# Altium project Wilamp_DCU.PrjPCB (part 1 of 2)
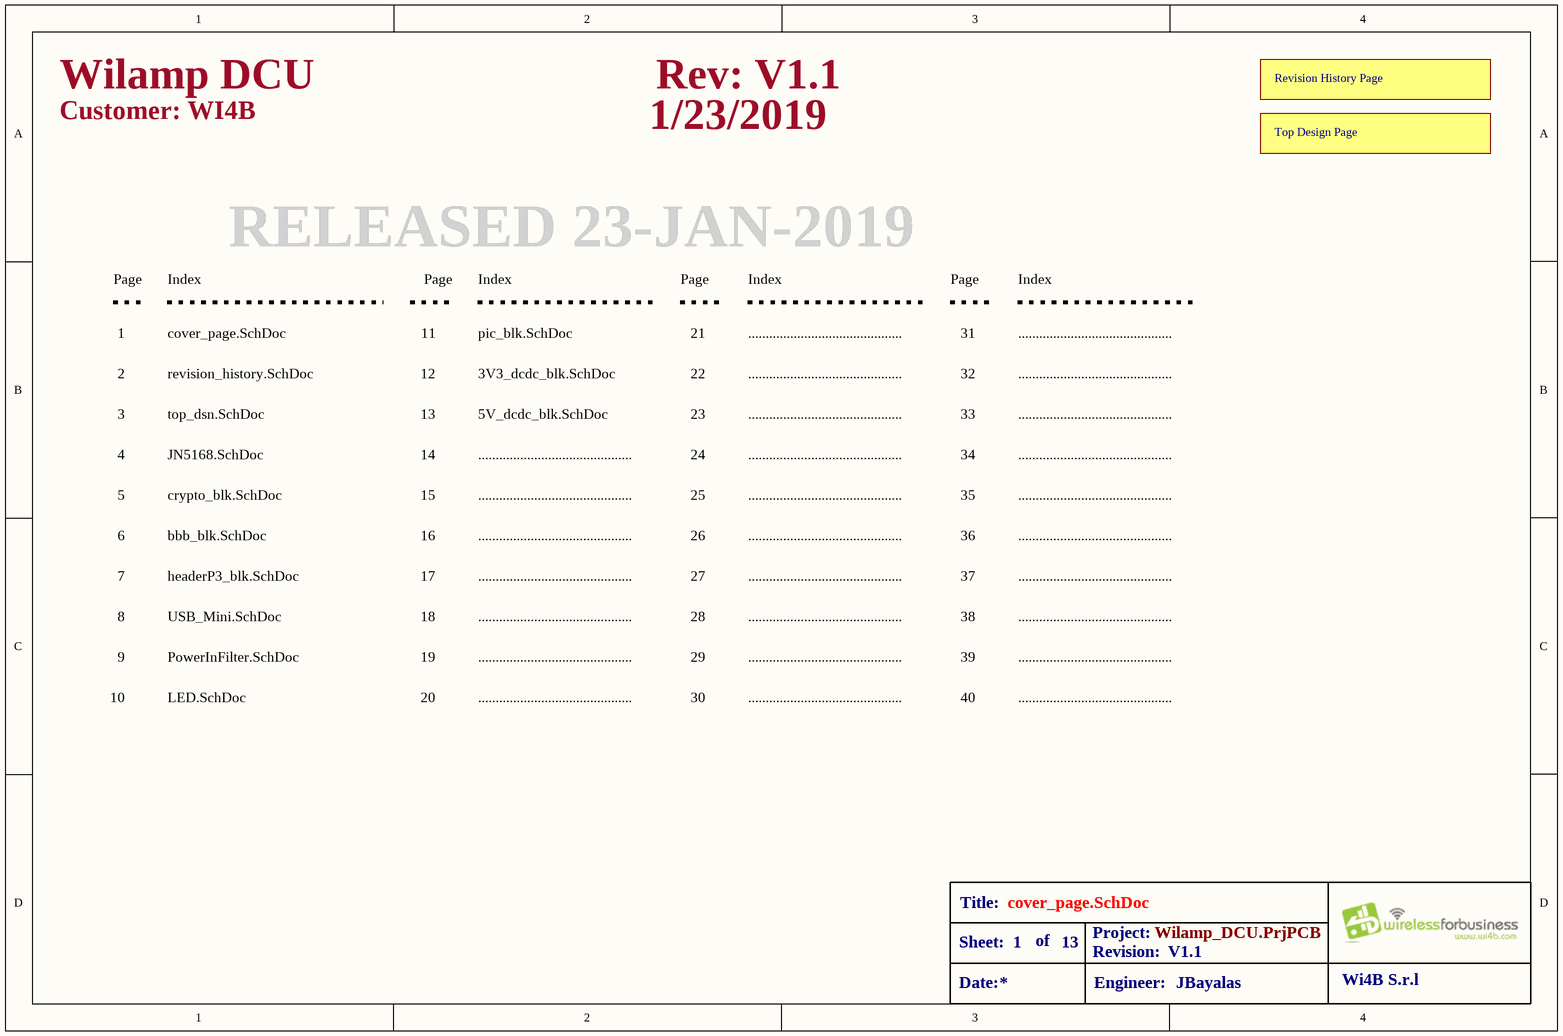
[diagram p0: cover_page.SchDoc]
13 sheets, 210 parts. Net scope: hierarchical (ports join the sheet entries above them; power ports are global).
Board file: wilamp_DCU.PcbDoc
Sheets:
  cover_page.SchDoc
    Top Design Page = top_dsn.SchDoc
      JN1 = JN5168.SchDoc
      JN2 = JN5168.SchDoc
      JN3 = JN5168.SchDoc
      crypto_blk = crypto_blk.SchDoc
      bbb_conn_blk = bbb_blk.SchDoc
      PFilter = PowerInFilter.SchDoc
      U_LED = LED.SchDoc
      U_USB_Mini = USB_Mini.SchDoc
      U_5v_dcdc_blk = 5v_dcdc_blk.SchDoc
      U_3v3_dcdc_blk = 3v3_dcdc_blk.SchDoc
      U_headerP3_blk = headerP3_blk.SchDoc
      U_pic_blk = pic_blk.SchDoc
    Revision History Page = revision_history.SchDoc

## Sheet cover_page.SchDoc
size A4; Date: 1/11/16; Engineer: JBayalas; DocumentNumber: 1; Revision: V1.1; SheetNumber: 1; SheetTotal: 13

### Sub-sheets
Revision History Page = revision_history.SchDoc: no entries
Top Design Page = top_dsn.SchDoc: no entries

### Notes on the sheet
- Wilamp DCU
- Rev: V1.1
- Customer: WI4B
- 1/23/2019
- Page
- Index
- RELEASED 23-JAN-2019
- 1
- 2
- revision_history.SchDoc
- cover_page.SchDoc
- 11
- 12
- 3V3_dcdc_blk.SchDoc
- pic_blk.SchDoc
- 21
- 22
- ............................................
- 31
- 32
- 3
- top_dsn.SchDoc
- 13
- 5V_dcdc_blk.SchDoc
- 23
- 33
- 4
- 5
- crypto_blk.SchDoc
- JN5168.SchDoc
- 14
- 15
- 24
- 25
- 34
- 35
- 6
- 7
- bbb_blk.SchDoc
- headerP3_blk.SchDoc
- 16
- 17
- 26
- 27
- 36
- 37
- 8
- USB_Mini.SchDoc
- 18
- 28
- 38
- 9
- 10
- PowerInFilter.SchDoc
- LED.SchDoc
- 19
- 20
- 29
- 30
- 39
- 40
- Title:
- Sheet:
- Date:
- of
- Project:
- Revision:
- Engineer:
- Wi4B S.r.l

## Sheet top_dsn.SchDoc
size A4; Date: 1/11/16; Engineer: JBayalas; DocumentNumber: 3; Revision: V1.1; SheetNumber: 3; SheetTotal: 13
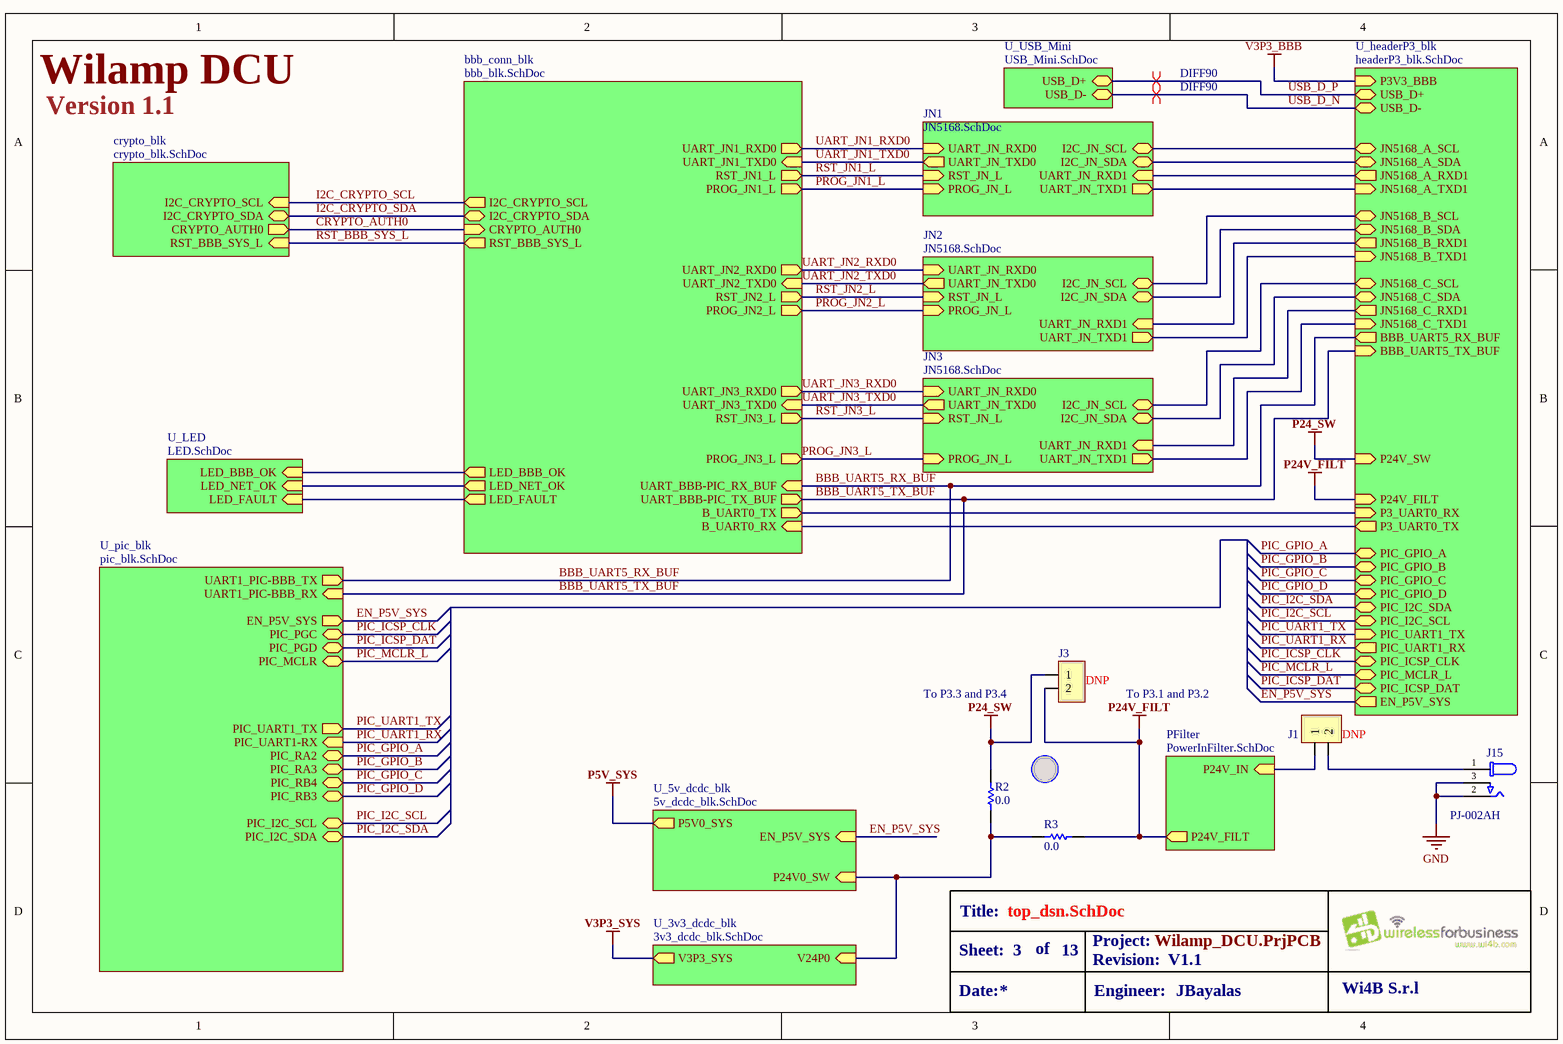
[diagram p1: top_dsn.SchDoc]

### Parts
J1  LOAD: DNP  [2pin 5mm Pitch]  (hidden comment: *)
J3  LOAD: DNP  [2pin 5mm Pitch]  (hidden comment: *)
J15  *  [PJ-002AH]  (value not drawn)
R2  value 0.0  [R0805]  (hidden comment: *)
R3  value 0.0  [R0805]  (hidden comment: *)

### Sub-sheets
bbb_conn_blk = bbb_blk.SchDoc: I2C_CRYPTO_SCL (out), I2C_CRYPTO_SDA (bidir), CRYPTO_AUTH0 (in), RST_BBB_SYS_L (out), UART_JN1_TXD0 (in), UART_JN1_RXD0 (out), UART_JN2_TXD0 (in), UART_JN2_RXD0 (out), UART_JN3_TXD0 (in), UART_JN3_RXD0 (out), LED_NET_OK (out), LED_BBB_OK (out), LED_FAULT (out), RST_JN1_L (out), RST_JN2_L (out), RST_JN3_L (out), PROG_JN1_L (out), PROG_JN2_L (out), PROG_JN3_L (out), UART_BBB-PIC_RX_BUF (in), UART_BBB-PIC_TX_BUF (out), B_UART0_RX (in), B_UART0_TX (out)
crypto_blk = crypto_blk.SchDoc: I2C_CRYPTO_SCL (in), I2C_CRYPTO_SDA (bidir), CRYPTO_AUTH0 (out), RST_BBB_SYS_L (in)
JN1 = JN5168.SchDoc: UART_JN_TXD0 (out), UART_JN_RXD0 (in), I2C_JN_SDA (bidir), I2C_JN_SCL (bidir), RST_JN_L (in), PROG_JN_L (in), UART_JN_TXD1 (out), UART_JN_RXD1 (in)
JN2 = JN5168.SchDoc: UART_JN_TXD0 (out), UART_JN_RXD0 (in), I2C_JN_SDA (bidir), I2C_JN_SCL (bidir), RST_JN_L (in), PROG_JN_L (in), UART_JN_TXD1 (out), UART_JN_RXD1 (in)
JN3 = JN5168.SchDoc: UART_JN_TXD0 (out), UART_JN_RXD0 (in), I2C_JN_SCL (bidir), I2C_JN_SDA (bidir), RST_JN_L (in), PROG_JN_L (in), UART_JN_TXD1 (out), UART_JN_RXD1 (in)
PFilter = PowerInFilter.SchDoc: P24V_FILT (out), P24V_IN (in)
U_3v3_dcdc_blk = 3v3_dcdc_blk.SchDoc: V3P3_SYS (out), V24P0 (in)
U_5v_dcdc_blk = 5v_dcdc_blk.SchDoc: P5V0_SYS (out), P24V0_SW (in), EN_P5V_SYS (in)
U_headerP3_blk = headerP3_blk.SchDoc: P3V3_BBB (in), PIC_ICSP_DAT (bidir), PIC_UART1_RX (out), BBB_UART5_TX_BUF (in), PIC_I2C_SDA (bidir), PIC_GPIO_B (bidir), PIC_GPIO_D (bidir), JN5168_A_RXD1 (out), JN5168_A_SDA (bidir), JN5168_B_RXD1 (out), JN5168_B_SDA (bidir), JN5168_C_RXD1 (out), JN5168_C_SDA (bidir), USB_D- (bidir), EN_P5V_SYS (out), PIC_ICSP_CLK (bidir), PIC_UART1_TX (in), BBB_UART5_RX_BUF (out), PIC_I2C_SCL (bidir), PIC_GPIO_A (bidir), PIC_GPIO_C (bidir), JN5168_A_TXD1 (in), JN5168_A_SCL (bidir), JN5168_B_TXD1 (in), JN5168_B_SCL (bidir), JN5168_C_TXD1 (in), JN5168_C_SCL (bidir), USB_D+ (bidir), PIC_MCLR_L (bidir), P24V_FILT (in), P24V_SW (in), P3_UART0_RX (in), P3_UART0_TX (out)
U_LED = LED.SchDoc: LED_BBB_OK (in), LED_NET_OK (in), LED_FAULT (in)
U_pic_blk = pic_blk.SchDoc: PIC_I2C_SCL (bidir), PIC_I2C_SDA (bidir), PIC_PGD (bidir), PIC_PGC (bidir), PIC_MCLR (bidir), PIC_RA2 (bidir), PIC_RA3 (bidir), UART1_PIC-BBB_RX (in), UART1_PIC-BBB_TX (out), PIC_UART1_TX (out), PIC_UART1-RX (in), EN_P5V_SYS (out), PIC_RB3 (bidir), PIC_RB4 (bidir)
U_USB_Mini = USB_Mini.SchDoc: USB_D+ (bidir), USB_D- (bidir)

### Nets
GND: J15.2 J15.3
P24_SW: J3.1 R2.2 ; sheet U_headerP3_blk/P24V_SW
P24V_FILT: J3.2 R3.2 ; sheet PFilter/P24V_FILT, sheet U_headerP3_blk/P24V_FILT
B_UART0_RX: sheet bbb_conn_blk/B_UART0_RX, sheet U_headerP3_blk/P3_UART0_TX
B_UART0_TX: sheet bbb_conn_blk/B_UART0_TX, sheet U_headerP3_blk/P3_UART0_RX
BBB_UART5_RX_BUF: sheet bbb_conn_blk/UART_BBB-PIC_RX_BUF, sheet U_headerP3_blk/BBB_UART5_RX_BUF, sheet U_pic_blk/UART1_PIC-BBB_TX
BBB_UART5_TX_BUF: sheet bbb_conn_blk/UART_BBB-PIC_TX_BUF, sheet U_headerP3_blk/BBB_UART5_TX_BUF, sheet U_pic_blk/UART1_PIC-BBB_RX
CRYPTO_AUTH0: sheet crypto_blk/CRYPTO_AUTH0, sheet bbb_conn_blk/CRYPTO_AUTH0
EN_P5V_SYS: sheet U_5v_dcdc_blk/EN_P5V_SYS, sheet U_headerP3_blk/EN_P5V_SYS, sheet U_pic_blk/EN_P5V_SYS
I2C_CRYPTO_SCL: sheet crypto_blk/I2C_CRYPTO_SCL, sheet bbb_conn_blk/I2C_CRYPTO_SCL
I2C_CRYPTO_SDA: sheet crypto_blk/I2C_CRYPTO_SDA, sheet bbb_conn_blk/I2C_CRYPTO_SDA
I2C_JN_SCL: sheet JN1/I2C_JN_SCL, sheet U_headerP3_blk/JN5168_A_SCL
I2C_JN_SCL: sheet JN2/I2C_JN_SCL, sheet U_headerP3_blk/JN5168_B_SCL  [a separate net that carries the same name]
I2C_JN_SCL: sheet JN3/I2C_JN_SCL, sheet U_headerP3_blk/JN5168_C_SCL  [a separate net that carries the same name]
I2C_JN_SDA: sheet JN1/I2C_JN_SDA, sheet U_headerP3_blk/JN5168_A_SDA
I2C_JN_SDA: sheet JN2/I2C_JN_SDA, sheet U_headerP3_blk/JN5168_B_SDA  [a separate net that carries the same name]
I2C_JN_SDA: sheet JN3/I2C_JN_SDA, sheet U_headerP3_blk/JN5168_C_SDA  [a separate net that carries the same name]
LED_BBB_OK: sheet bbb_conn_blk/LED_BBB_OK, sheet U_LED/LED_BBB_OK
LED_FAULT: sheet bbb_conn_blk/LED_FAULT, sheet U_LED/LED_FAULT
LED_NET_OK: sheet bbb_conn_blk/LED_NET_OK, sheet U_LED/LED_NET_OK
P24V: J1.1 ; sheet PFilter/P24V_IN
PIC_GPIO_A: sheet U_headerP3_blk/PIC_GPIO_A, sheet U_pic_blk/PIC_RA2
PIC_GPIO_B: sheet U_headerP3_blk/PIC_GPIO_B, sheet U_pic_blk/PIC_RA3
PIC_GPIO_C: sheet U_headerP3_blk/PIC_GPIO_C, sheet U_pic_blk/PIC_RB4
PIC_GPIO_D: sheet U_headerP3_blk/PIC_GPIO_D, sheet U_pic_blk/PIC_RB3
PIC_I2C_SCL: sheet U_headerP3_blk/PIC_I2C_SCL, sheet U_pic_blk/PIC_I2C_SCL
PIC_I2C_SDA: sheet U_headerP3_blk/PIC_I2C_SDA, sheet U_pic_blk/PIC_I2C_SDA
PIC_ICSP_CLK: sheet U_headerP3_blk/PIC_ICSP_CLK, sheet U_pic_blk/PIC_PGC
PIC_ICSP_DAT: sheet U_headerP3_blk/PIC_ICSP_DAT, sheet U_pic_blk/PIC_PGD
PIC_MCLR_L: sheet U_headerP3_blk/PIC_MCLR_L, sheet U_pic_blk/PIC_MCLR  [project net PIC_MCLR]
PIC_UART1_RX: sheet U_headerP3_blk/PIC_UART1_RX, sheet U_pic_blk/PIC_UART1-RX
PIC_UART1_TX: sheet U_headerP3_blk/PIC_UART1_TX, sheet U_pic_blk/PIC_UART1_TX
PROG_JN1_L: sheet JN1/PROG_JN_L, sheet bbb_conn_blk/PROG_JN1_L
PROG_JN2_L: sheet JN2/PROG_JN_L, sheet bbb_conn_blk/PROG_JN2_L
PROG_JN3_L: sheet JN3/PROG_JN_L, sheet bbb_conn_blk/PROG_JN3_L
RST_BBB_SYS_L: sheet crypto_blk/RST_BBB_SYS_L, sheet bbb_conn_blk/RST_BBB_SYS_L
RST_JN1_L: sheet JN1/RST_JN_L, sheet bbb_conn_blk/RST_JN1_L
RST_JN2_L: sheet JN2/RST_JN_L, sheet bbb_conn_blk/RST_JN2_L
RST_JN3_L: sheet JN3/RST_JN_L, sheet bbb_conn_blk/RST_JN3_L
UART_JN1_RXD0: sheet JN1/UART_JN_RXD0, sheet bbb_conn_blk/UART_JN1_RXD0
UART_JN1_TXD0: sheet JN1/UART_JN_TXD0, sheet bbb_conn_blk/UART_JN1_TXD0
UART_JN2_RXD0: sheet JN2/UART_JN_RXD0, sheet bbb_conn_blk/UART_JN2_RXD0
UART_JN2_TXD0: sheet JN2/UART_JN_TXD0, sheet bbb_conn_blk/UART_JN2_TXD0
UART_JN3_RXD0: sheet JN3/UART_JN_RXD0, sheet bbb_conn_blk/UART_JN3_RXD0
UART_JN3_TXD0: sheet JN3/UART_JN_TXD0, sheet bbb_conn_blk/UART_JN3_TXD0
USB_D_N: sheet U_USB_Mini/USB_D-, sheet U_headerP3_blk/USB_D-
USB_D_P: sheet U_USB_Mini/USB_D+, sheet U_headerP3_blk/USB_D+
V24P0: R2.1 R3.1 ; sheet U_5v_dcdc_blk/P24V0_SW, sheet U_3v3_dcdc_blk/V24P0
NetJ1_2: J1.2 J15.1
NetP3_29: sheet JN1/UART_JN_TXD1, sheet U_headerP3_blk/JN5168_A_TXD1
NetP3_30: sheet JN1/UART_JN_RXD1, sheet U_headerP3_blk/JN5168_A_RXD1
NetP3_33: sheet JN2/UART_JN_TXD1, sheet U_headerP3_blk/JN5168_B_TXD1
NetP3_34: sheet JN2/UART_JN_RXD1, sheet U_headerP3_blk/JN5168_B_RXD1
NetP3_37: sheet JN3/UART_JN_TXD1, sheet U_headerP3_blk/JN5168_C_TXD1
NetP3_38: sheet JN3/UART_JN_RXD1, sheet U_headerP3_blk/JN5168_C_RXD1

### Layout directives
differential pair; net class DIFF90: USB_D_N, USB_D_P

### Notes on the sheet
- Version 1.1
- Wilamp DCU
- (near J3) To P3.3 and P3.4
- To P3.1 and P3.2
- Title:
- Sheet:
- Date:
- of
- Project:
- Revision:
- Engineer:
- Wi4B S.r.l

### Library data of the parts
J1 J3 = 2PIN Signal 5mm Pitch: FUNCTION: TOP
J15 = PJ-002AH: CONN PWR JACK 2.1X5.5MM HIGH CUR; MFT: CUI Inc.; FUNCTION: TOP; VALUE: PJ-002AH; TYPE: TH; RATING: *; LOAD: *; MPN: PJ-002AH
R2 R3 = RC0805JR-070RL: RES SMD 0.0 OHM JUMPER 1/8W 0805; MFT: Yageo; FUNCTION: TOP; MPN: RC0805JR-070RL; TYPE: Surface Mount; RATING: 1/8W

## Sheet JN5168.SchDoc
size A4; Date: 1/11/2016; Engineer: JBayalas; DocumentNumber: 4; Revision: V1.1; SheetNumber: 4; SheetTotal: 13
Used 3 times, as channels Top Design Page/JN1, Top Design Page/JN2, Top Design Page/JN3. Parts and nets are listed once, with the designators drawn on the sheet.
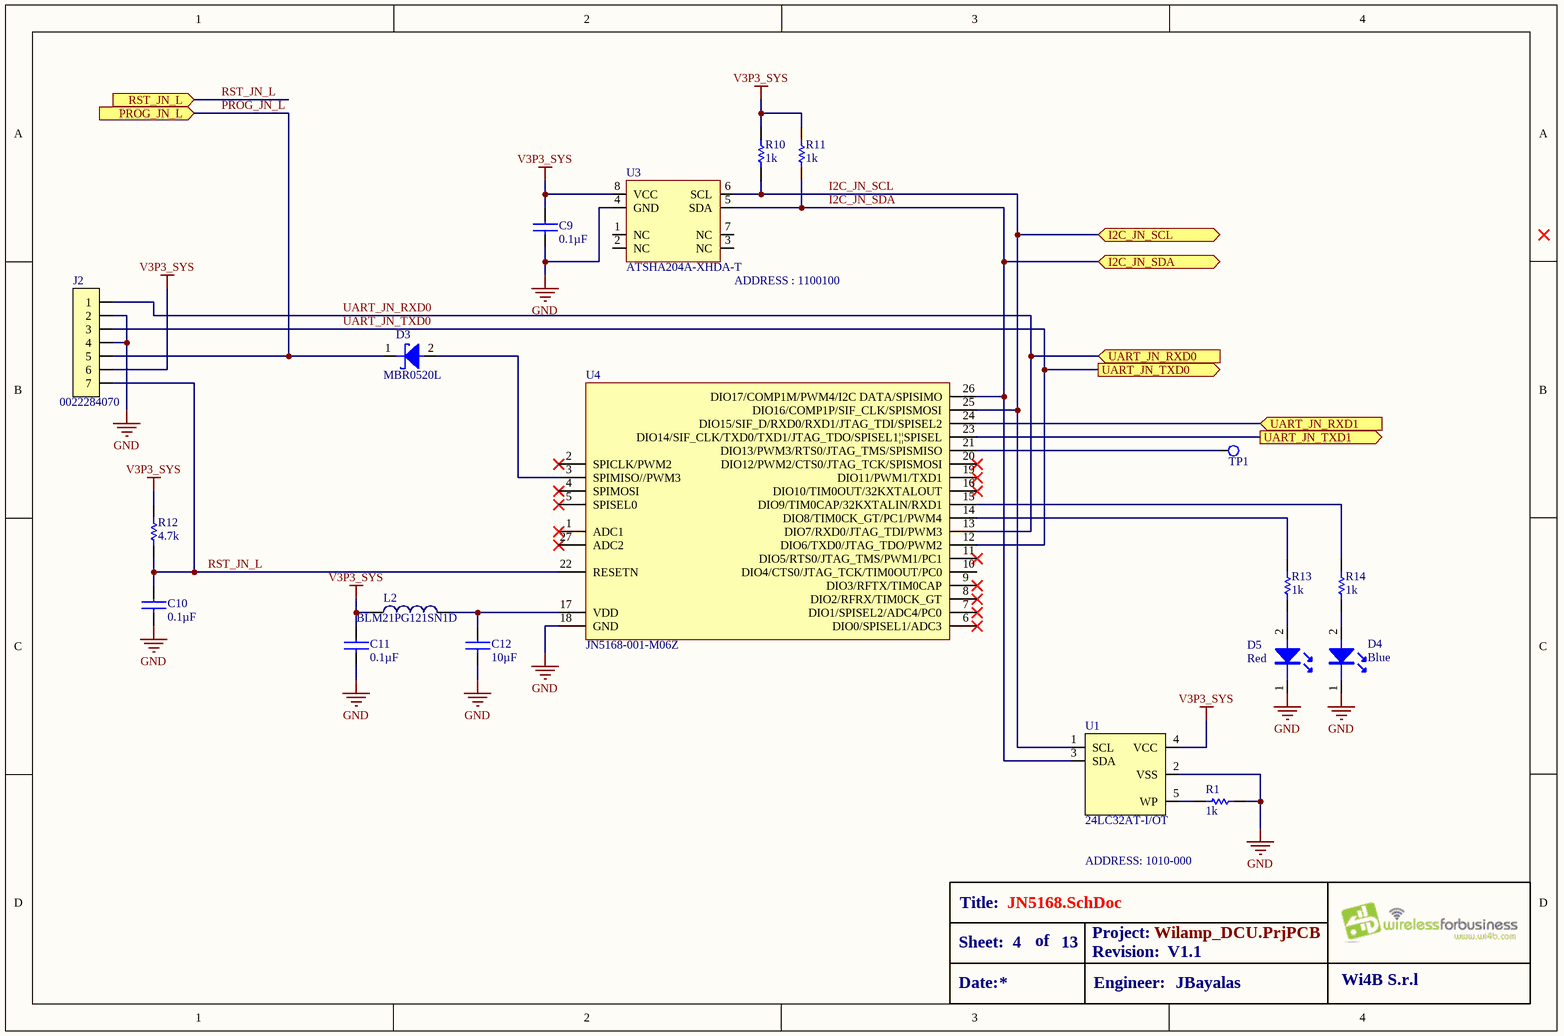
[diagram p2: JN5168.SchDoc]

### Parts
C9  value 0.1µF  [C0402]  (hidden comment: *)
C10  value 0.1µF  [C0402]  (hidden comment: *)
C11  value 0.1µF  [C0402]  (hidden comment: *)
C12  value 10µF  [C0805]  (hidden comment: *)
D3  MBR0520L  [SOD123]
D4  value Blue  [LED-0603 (BLUE)]  (hidden comment: *)
D5  value Red  [LED0805 - (RED)]  (hidden comment: *)
J2  *  [0022284070]  (value not drawn)
L2  *  [0805 INDUCTOR]  (value not drawn)
R1  value 1k  [R0402]  (hidden comment: *)
R10  value 1k  [R0402]  (hidden comment: *)
R11  value 1k  [R0402]  (hidden comment: *)
R12  value 4.7k  [R0603]  (hidden comment: *)
R13  value 1k  [R0603]  (hidden comment: *)
R14  value 1k  [R0603]  (hidden comment: *)
TP1  *  [Test Point 1.27mm]  (value not drawn)
U1  *  [SOT-23-5]  (value not drawn)
U3  ATSHA204A-XHDA-T  [TSSOP-8 (wide Body)]
U4  JN5168-001-M06Z  [JN5168-001-M06Z]

### Ports
I2C_JN_SCL (bidir), I2C_JN_SDA (bidir), PROG_JN_L (in), RST_JN_L (in), UART_JN_RXD0 (in), UART_JN_RXD1 (in), UART_JN_TXD0 (out), UART_JN_TXD1 (out)

### Nets
GND: C9.2 C10.2 C11.2 C12.2 D4.1 D5.1 J2.2 J2.4 R1.2 U1.2(VSS) U3.4(GND) U4.18(GND)
V3P3_SYS: C9.1 C11.1 J2.6 L2.2 R10.2 R11.2 R12.2 U1.4(VCC) U3.8(VCC)
I2C_JN_SCL: R10.1 U1.1(SCL) U3.6(SCL) U4.25(DIO16/COMP1P/SIF_CLK/SPISMOSI) ; port I2C_JN_SCL
I2C_JN_SDA: R11.1 U1.3(SDA) U3.5(SDA) U4.26(DIO17/COMP1M/PWM4/I2C_DATA/SPISIMO) ; port I2C_JN_SDA
PROG_JN_L: D3.1(cathode) J2.5 ; port PROG_JN_L
RST_JN_L: C10.1 J2.7 R12.1 U4.22(RESETN) ; port RST_JN_L
UART_JN_RXD0: J2.1 U4.13(DIO7/RXD0/JTAG_TDI/PWM3) ; port UART_JN_RXD0
UART_JN_RXD1: U4.24(DIO15/SIF_D/RXD0/RXD1/JTAG_TDI/SPISEL2) ; port UART_JN_RXD1
UART_JN_TXD0: J2.3 U4.12(DIO6/TXD0/JTAG_TDO/PWM2) ; port UART_JN_TXD0
UART_JN_TXD1: U4.23(DIO14/SIF_CLK/TXD0/TXD1/JTAG_TDO/SPISEL1||SPISEL) ; port UART_JN_TXD1
NetC12_1: C12.1 L2.1 U4.17(VDD)
NetD3_2: D3.2(anode) U4.3(SPIMISO//PWM3)
NetD4_2: D4.2 R14.2
NetD5_2: D5.2 R13.2
NetR1_1: R1.1 U1.5(WP)
NetR13_1: R13.1 U4.14(DIO8/TIM0CK_GT/PC1/PWM4)
NetR14_1: R14.1 U4.15(DIO9/TIM0CAP/32KXTALIN/RXD1)
NetTP1_1: TP1.1 U4.21(DIO13/PWM3/RTS0/JTAG_TMS/SPISMISO)

Not connected (* = marked no-connect by the designer): U3 1(NC) 2(NC) 3(NC) 7(NC); U4 1(ADC1)* 2(SPICLK/PWM2)* 4(SPIMOSI)* 5(SPISEL0)* 6(DIO0/SPISEL1/ADC3)* 7(DIO1/SPISEL2/ADC4/PC0)* 8(DIO2/RFRX/TIM0CK_GT)* 9(DIO3/RFTX/TIM0CAP)* 10(DIO4/CTS0/JTAG_TCK/TIM0OUT/PC0) 11(DIO5/RTS0/JTAG_TMS/PWM1/PC1)* 16(DIO10/TIM0OUT/32KXTALOUT)* 19(DIO11/PWM1/TXD1)* 20(DIO12/PWM2/CTS0/JTAG_TCK/SPISMOSI)* 27(ADC2)*

### Channels
Top Design Page/JN1: designators end in _JN1; ports I2C_JN_SCL=I2C_JN_SCL I2C_JN_SDA=I2C_JN_SDA PROG_JN_L=PROG_JN1_L RST_JN_L=RST_JN1_L UART_JN_RXD0=UART_JN1_RXD0 UART_JN_RXD1=NetP3_30 UART_JN_TXD0=UART_JN1_TXD0 UART_JN_TXD1=NetP3_29
Top Design Page/JN2: designators end in _JN2; ports I2C_JN_SCL=I2C_JN_SCL I2C_JN_SDA=I2C_JN_SDA PROG_JN_L=PROG_JN2_L RST_JN_L=RST_JN2_L UART_JN_RXD0=UART_JN2_RXD0 UART_JN_RXD1=NetP3_34 UART_JN_TXD0=UART_JN2_TXD0 UART_JN_TXD1=NetP3_33
Top Design Page/JN3: designators end in _JN3; ports I2C_JN_SCL=I2C_JN_SCL I2C_JN_SDA=I2C_JN_SDA PROG_JN_L=PROG_JN3_L RST_JN_L=RST_JN3_L UART_JN_RXD0=UART_JN3_RXD0 UART_JN_RXD1=NetP3_38 UART_JN_TXD0=UART_JN3_TXD0 UART_JN_TXD1=NetP3_37

### Notes on the sheet
- (near U3) ADDRESS : 1100100
- ADDRESS: 1010-000
- Title:
- Sheet:
- Date:
- of
- Project:
- Revision:
- Engineer:
- Wi4B S.r.l

### Library data of the parts
C9-C11 = CL05B104KO3LNNC: CAP CER 0.1UF 16V X7R 0402; MFT: Samsung Electro-Mechanics America, Inc.; RATING: ±10%, 16V; TYPE: Surface Mount, MLCC; FUNCTION: JENNIC; MPN: CL05B104KO3LNNC
C12 = GRM219R60J106KE19D: CAP CER 10UF 6.3V X5R 0805; MFT: Murata Electronics North America; TYPE: Surface Mount, MLCC; FUNCTION: JENNIC; MPN: GRM219R60J106KE19D; RATING: 6.3V
D3 = MBR0520L: DIODE SCHOTTKY 20V 0.5A SOD123; MFT: ON Semiconductor; TYPE: SMD; RATING: 20V 500MA; FUNCTION: JENNIC; VALUE: MBR0520L; MPN: MBR0520L
D4 = LTST-C191TBKT: LED BLUE CLEAR 0603 SMD; MFT: Lite-On Inc.; TYPE: Surface Mount; FUNCTION: JENNIC; MPN: LTST-C191TBKT
D5 = LS R976-NR-1: LED CHIPLED 633NM RED 0805 SMD; MFT: OSRAM Opto Semiconductors Inc.; FUNCTION: JENNIC; MPN: LS R976-NR-1
J2 = 0022284070: CONN HEADER 7POS .100 VERT TIN; MFT: Molex, LLC; FUNCTION: JENNIC; VALUE: 0022284070; TYPE: TH; RATING: *; LOAD: *; MPN: 0022284070
L2 = BLM21PG121SN1D: FERRITE CHIP 120 OHM 0805; MFT: Murata Electronics North America; RATING: 3A; TYPE: Surface Mount; VALUE: 120 Ohm; FUNCTION: JENNIC; MPN: BLM21PG121SN1D
R1 R10 R11 = MCS04020C1001FE000: RES SMD 1K OHM 1% 1/10W 0402; MFT: Vishay Beyschlag; FUNCTION: JENNIC; MPN: MCS04020C1001FE000; TYPE: SMD; RATING: 1/10W; LOAD: *
R12 = ERA-3AEB472V: RES SMD 4.7K OHM 0.1% 1/10W 0603; MFT: Panasonic; FUNCTION: JENNIC; MPN: ERA-3AEB472V; LOAD: *; RATING: 1/10W; TYPE: SMD
R13 R14 = ERJ-3EKF1001V: RES SMD 1K OHM 1% 1/10W 0603; MFT: Panasonic Electronic Components; RATING: 0.1W; FUNCTION: JENNIC; MPN: ERJ-3EKF1001V; TYPE: Surface Mount
TP1 = Test Point: Test Point 1.27mm; FUNCTION: JENNIC
U1 = 24LC32AT-I/OT: IC EEPROM 32KBIT 400KHZ SOT23-5; MFT: Microchip Technology; FUNCTION: JENNIC; VALUE: 24LC32AT-I/OT; TYPE: SMD; RATING: *; LOAD: *; MPN: 24LC32AT-I/OT
U3 = ATSHA204A-XHDA-T: IC CRYPTO 4.5KB I2C; MFT: Microchip Technology; FUNCTION: JENNIC; LOAD: *; TYPE: SMD; VALUE: ATSHA204A-XHDA-T; RATING: *; MPN: ATSHA204A-XHDA-T
U4 = JN5168-001-M06Z: RF TXRX MODULE 802.15.4 U.FL ANT; MFT: NXP USA Inc.; FUNCTION: JENNIC; VALUE: JN5168-001-M06Z; TYPE: SMD; RATING: *; LOAD: *; MPN: JN5168-001-M06Z

## Sheet crypto_blk.SchDoc
size A4; Engineer: JBayalas; DocumentNumber: 5; Revision: V1.1; SheetNumber: 5; SheetTotal: 13
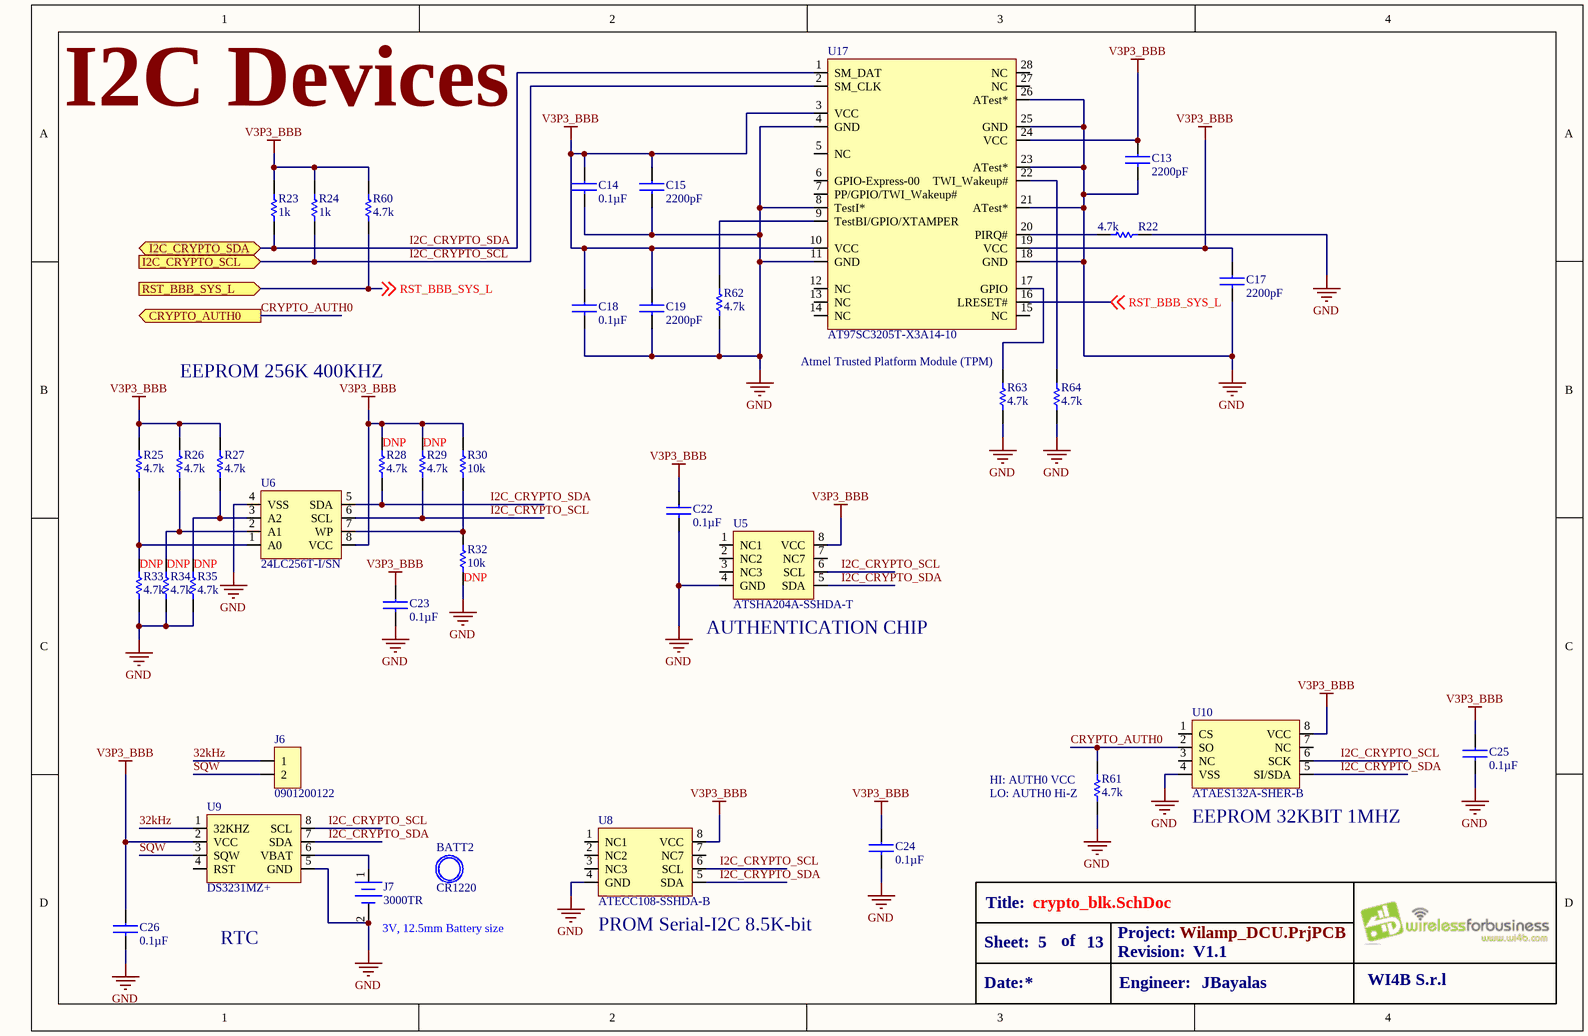
[diagram p3: crypto_blk.SchDoc]

### Parts
BATT2  CR1220
C13  value 2200pF  [C0805]  (hidden comment: *)
C14  value 0.1µF  [C0402]  (hidden comment: *)
C15  value 2200pF  [C0805]  (hidden comment: *)
C17  value 2200pF  [C0603]  (hidden comment: *)
C18  value 0.1µF  [C0402]  (hidden comment: *)
C19  value 2200pF  [C0805]  (hidden comment: *)
C22  value 0.1µF  [C0402]  (hidden comment: *)
C23  value 0.1µF  [C0402]  (hidden comment: *)
C24  value 0.1µF  [C0402]  (hidden comment: *)
C25  value 0.1µF  [C0402]  (hidden comment: *)
C26  value 0.1µF  [C0402]  (hidden comment: *)
J6  *  [0901200122]  (value not drawn)
J7  3000TR  [3000TR]
R22  value 4.7k  [R0402]  (hidden comment: RC0402JR-074K7L)
R23  value 1k  [R0402]  (hidden comment: *)
R24  value 1k  [R0402]  (hidden comment: *)
R25  value 4.7k  [R0402]  (hidden comment: *)
R26  value 4.7k  [R0402]  (hidden comment: *)
R27  value 4.7k  [R0402]  (hidden comment: *)
R28  value 4.7k  LOAD: DNP  [R0402]  (hidden comment: *)
R29  value 4.7k  LOAD: DNP  [R0402]  (hidden comment: *)
R30  value 10k  [R0402]  (hidden comment: *)
R32  value 10k  LOAD: DNP  [R0402]  (hidden comment: *)
R33  value 4.7k  LOAD: DNP  [R0402]  (hidden comment: *)
R34  value 4.7k  LOAD: DNP  [R0402]  (hidden comment: *)
R35  value 4.7k  LOAD: DNP  [R0402]  (hidden comment: *)
R60  value 4.7k  [R0402]  (hidden comment: *)
R61  value 4.7k  [R0402]  (hidden comment: *)
R62  value 4.7k  [R0402]  (hidden comment: RC0402JR-074K7L)
R63  value 4.7k  [R0402]  (hidden comment: RC0402JR-074K7L)
R64  value 4.7k  [R0402]  (hidden comment: RC0402JR-074K7L)
U5  value ATSHA204A-SSHDA-T  [SOIC-8]  (hidden comment: *)
U6  value 24LC256T-I/SN  [SOIC-8]  (hidden comment: *)
U8  value ATECC108-SSHDA-B  [SOIC-8]  (hidden comment: *)
U9  value DS3231MZ+  [SOIC-8]  (hidden comment: *)
U10  ATAES132A-SHER-B  [SOIC-8]
U17  AT97SC3205T-X3A14-10  [TSSOP-28]

### Ports
CRYPTO_AUTH0 (out), I2C_CRYPTO_SCL (in), I2C_CRYPTO_SDA (bidir), RST_BBB_SYS_L (in)

### Nets
GND: C13.2 C14.2 C15.2 C17.2 C18.2 C19.2 C22.2 C23.2 C24.2 C25.2 C26.2 J7.2(-) R22.1 R32.1 R33.1 R34.1 R35.1 R61.1 R62.1 R63.1 R64.1 U5.4(GND) U6.4(VSS) U8.4(GND) U9.5(GND) U10.4(VSS) U17.4(GND) U17.8(TestI*) U17.11(GND) U17.18(GND) U17.21(ATest*) U17.23(ATest*) U17.25(GND) U17.26(ATest*)
V3P3_BBB: C13.1 C14.1 C15.1 C17.1 C18.1 C19.1 C22.1 C23.1 C24.1 C25.1 C26.1 R23.1 R24.1 R25.2 R26.2 R27.2 R28.2 R29.2 R30.2 R60.2 U5.8(VCC) U6.8(VCC) U8.8(VCC) U9.2(VCC) U10.8(VCC) U17.3(VCC) U17.10(VCC) U17.19(VCC) U17.24(VCC)
32kHz: J6.1 U9.1(32KHZ)
CRYPTO_AUTH0: R61.2 U10.2(SO) ; port CRYPTO_AUTH0
I2C_CRYPTO_SCL: R24.2 R29.1 U5.6(SCL) U6.6(SCL) U8.6(SCL) U9.8(SCL) U10.6(SCK) U17.2(SM_CLK) ; port I2C_CRYPTO_SCL
I2C_CRYPTO_SDA: R23.2 R28.1 U5.5(SDA) U6.5(SDA) U8.5(SDA) U9.7(SDA) U10.5(SI/SDA) U17.1(SM_DAT) ; port I2C_CRYPTO_SDA
RST_BBB_SYS_L: R60.1 U17.16(LRESET#) ; off-sheet RST_BBB_SYS_L, port RST_BBB_SYS_L
SQW: J6.2 U9.3(SQW)
NetJ7_1: J7.1(+) U9.6(VBAT)
NetR22_2: R22.2 U17.20(PIRQ#)
NetR25_1: R25.1 R33.2 U6.1(A0)
NetR26_1: R26.1 R34.2 U6.2(A1)
NetR27_1: R27.1 R35.2 U6.3(A2)
NetR30_1: R30.1 R32.2 U6.7(WP)
NetR62_2: R62.2 U17.9(TestBI/GPIO/XTAMPER)
NetR63_2: R63.2 U17.17(GPIO)
NetR64_2: R64.2 U17.22(TWI_Wakeup#)

Not connected (* = marked no-connect by the designer): U5 1(NC1) 2(NC2) 3(NC3) 7(NC7); U8 1(NC1) 2(NC2) 3(NC3) 7(NC7); U9 4(RST); U10 1(CS) 3(NC) 7(NC); U17 5(NC) 6(GPIO-Express-00) 7(PP/GPIO/TWI_Wakeup#) 12(NC) 13(NC) 14(NC) 15(NC) 27(NC) 28(NC)

### Notes on the sheet
- I2C Devices
- EEPROM 256K 400KHZ
- (near R63) Atmel Trusted Platform Module (TPM)
- (near U5) AUTHENTICATION CHIP
- (near R61) HI: AUTH0 VCC
- (near R61) LO: AUTH0 Hi-Z
- (near U10) EEPROM 32KBIT 1MHZ
- RTC
- (near J7) 3V, 12.5mm Battery size
- (near U8) PROM Serial-I2C 8.5K-bit
- Title:
- Sheet:
- Date:
- of
- Project:
- Revision:
- Engineer:
- WI4B S.r.l

### Library data of the parts
BATT2 = CR1220: Coin Cell Battery 35mAh 12.5mm; MFT: FDK; RATING: 3V, 35mAh; FUNCTION: CRYPTO; TYPE: SMD; LOAD: *; VALUE: CR1220; MPN: CR1220
C13 C15 C19 = 08055C222KAT2A: CAP CER 2200PF 50V 10% X7R 0805; MFT: AVX Corporation; TYPE: Surface Mount, MLCC; FUNCTION: CRYPTO; MPN: 08055C222KAT2A; RATING: 50V 10% X7R
C14 C18 C22-C26 = CL05B104KO3LNNC: CAP CER 0.1UF 16V X7R 0402; MFT: Samsung Electro-Mechanics America, Inc.; RATING: ±10%, 16V; TYPE: Surface Mount, MLCC; FUNCTION: CRYPTO; MPN: CL05B104KO3LNNC
C17 = C0603C222K5RACTU: CAP CER 2200PF 50V X7R 0603; MFT: KEMET; TYPE: SMD; FUNCTION: CRYPTO; MPN: C0603C222K5RACTU; LOAD: *; RATING: 50V
J6 = 0901200122: CONN HEADER 2POS .100" STR TIN; MFT: Molex, LLC; FUNCTION: CRYPTO; TYPE: Through Hole; VALUE: 0901200122; MPN: 0901200122
J7 = 3000TR: Coin Cell Battery Holders SM COIN CELL B/H; MFT: Keystone Electronics; FUNCTION: CRYPTO; MPN: 3000TR; TYPE: SMD; RATING: *; LOAD: *; VALUE: 3000TR
R22 R25-R29 R33-R35 R60-R64 = RC0402JR-074K7L: RES SMD 4.7K OHM 5% 1/16W 0402; MFT: Yageo; FUNCTION: CRYPTO; MPN: RC0402JR-074K7L; RATING: ±5%; TYPE: Surface Mount
R23 R24 = MCS04020C1001FE000: RES SMD 1K OHM 1% 1/10W 0402; MFT: Vishay Beyschlag; FUNCTION: CRYPTO; MPN: MCS04020C1001FE000; TYPE: SMD; RATING: 1/10W; LOAD: *
R30 R32 = CRCW040210K0FKEDHP: RES SMD 10K OHM 1% 1/5W 0402; MFT: Vishay Dale; RATING: 0.2W, 1/5W; FUNCTION: CRYPTO; MPN: CRCW040210K0FKEDHP; TYPE: Surface Mount
U5 = ATSHA204A-SSHDA-T: IC AUTHENTICATION CHIP 8SOIC; MFT: Microchip Technology; FUNCTION: CRYPTO; MPN: ATSHA204A-SSHDA-T; LOAD: *; RATING: *; TYPE: SMD
U6 = 24LC256T-I/SN: IC EEPROM 256K I2C 400KHZ 8SOIC; MFT: Microchip Technology; FUNCTION: CRYPTO; LOAD: *; RATING: *; TYPE: SMD; MPN: 24LC256T-I/SN
U8 = ATECC108-SSHDA-B: EEPROM Serial-I2C 8.5K-bit 2.5V/3.3V/5V 8-Pin SOIC Bulk; MFT: Microchip / Atmel; FUNCTION: CRYPTO; MPN: ATECC108-SSHDA-B; TYPE: SMD; RATING: 2.5V/3.3V/5V; LOAD: *
U9 = DS3231MZ+: IC RTC I2C 8SOIC; MFT: Maxim; FUNCTION: CRYPTO; MPN: DS3231MZ+; TYPE: SMD; RATING: *; LOAD: *
U10 = ATAES132A-SHER-B: IC EEPROM 32KBIT 1MHZ 8SOIC; MFT: Microchip; FUNCTION: CRYPTO; MPN: ATAES132A-SHER-B; LOAD: *; RATING: *; TYPE: SMD; VALUE: ATAES132A-SHER-B
U17 = AT97SC3205T-X3A14-10: STD COM 12C TPM 4.4 MM TSSOP UEK; MFT: Microchip / Atmel; FUNCTION: CRYPTO; MPN: AT97SC3205T-X3A14-10; TYPE: SMD; RATING: *; LOAD: *; VALUE: AT97SC3205T-X3A14-10

## Sheet bbb_blk.SchDoc
size A4; Engineer: JBayalas; DocumentNumber: 7; Revision: V2.0; SheetNumber: 7; SheetTotal: 14
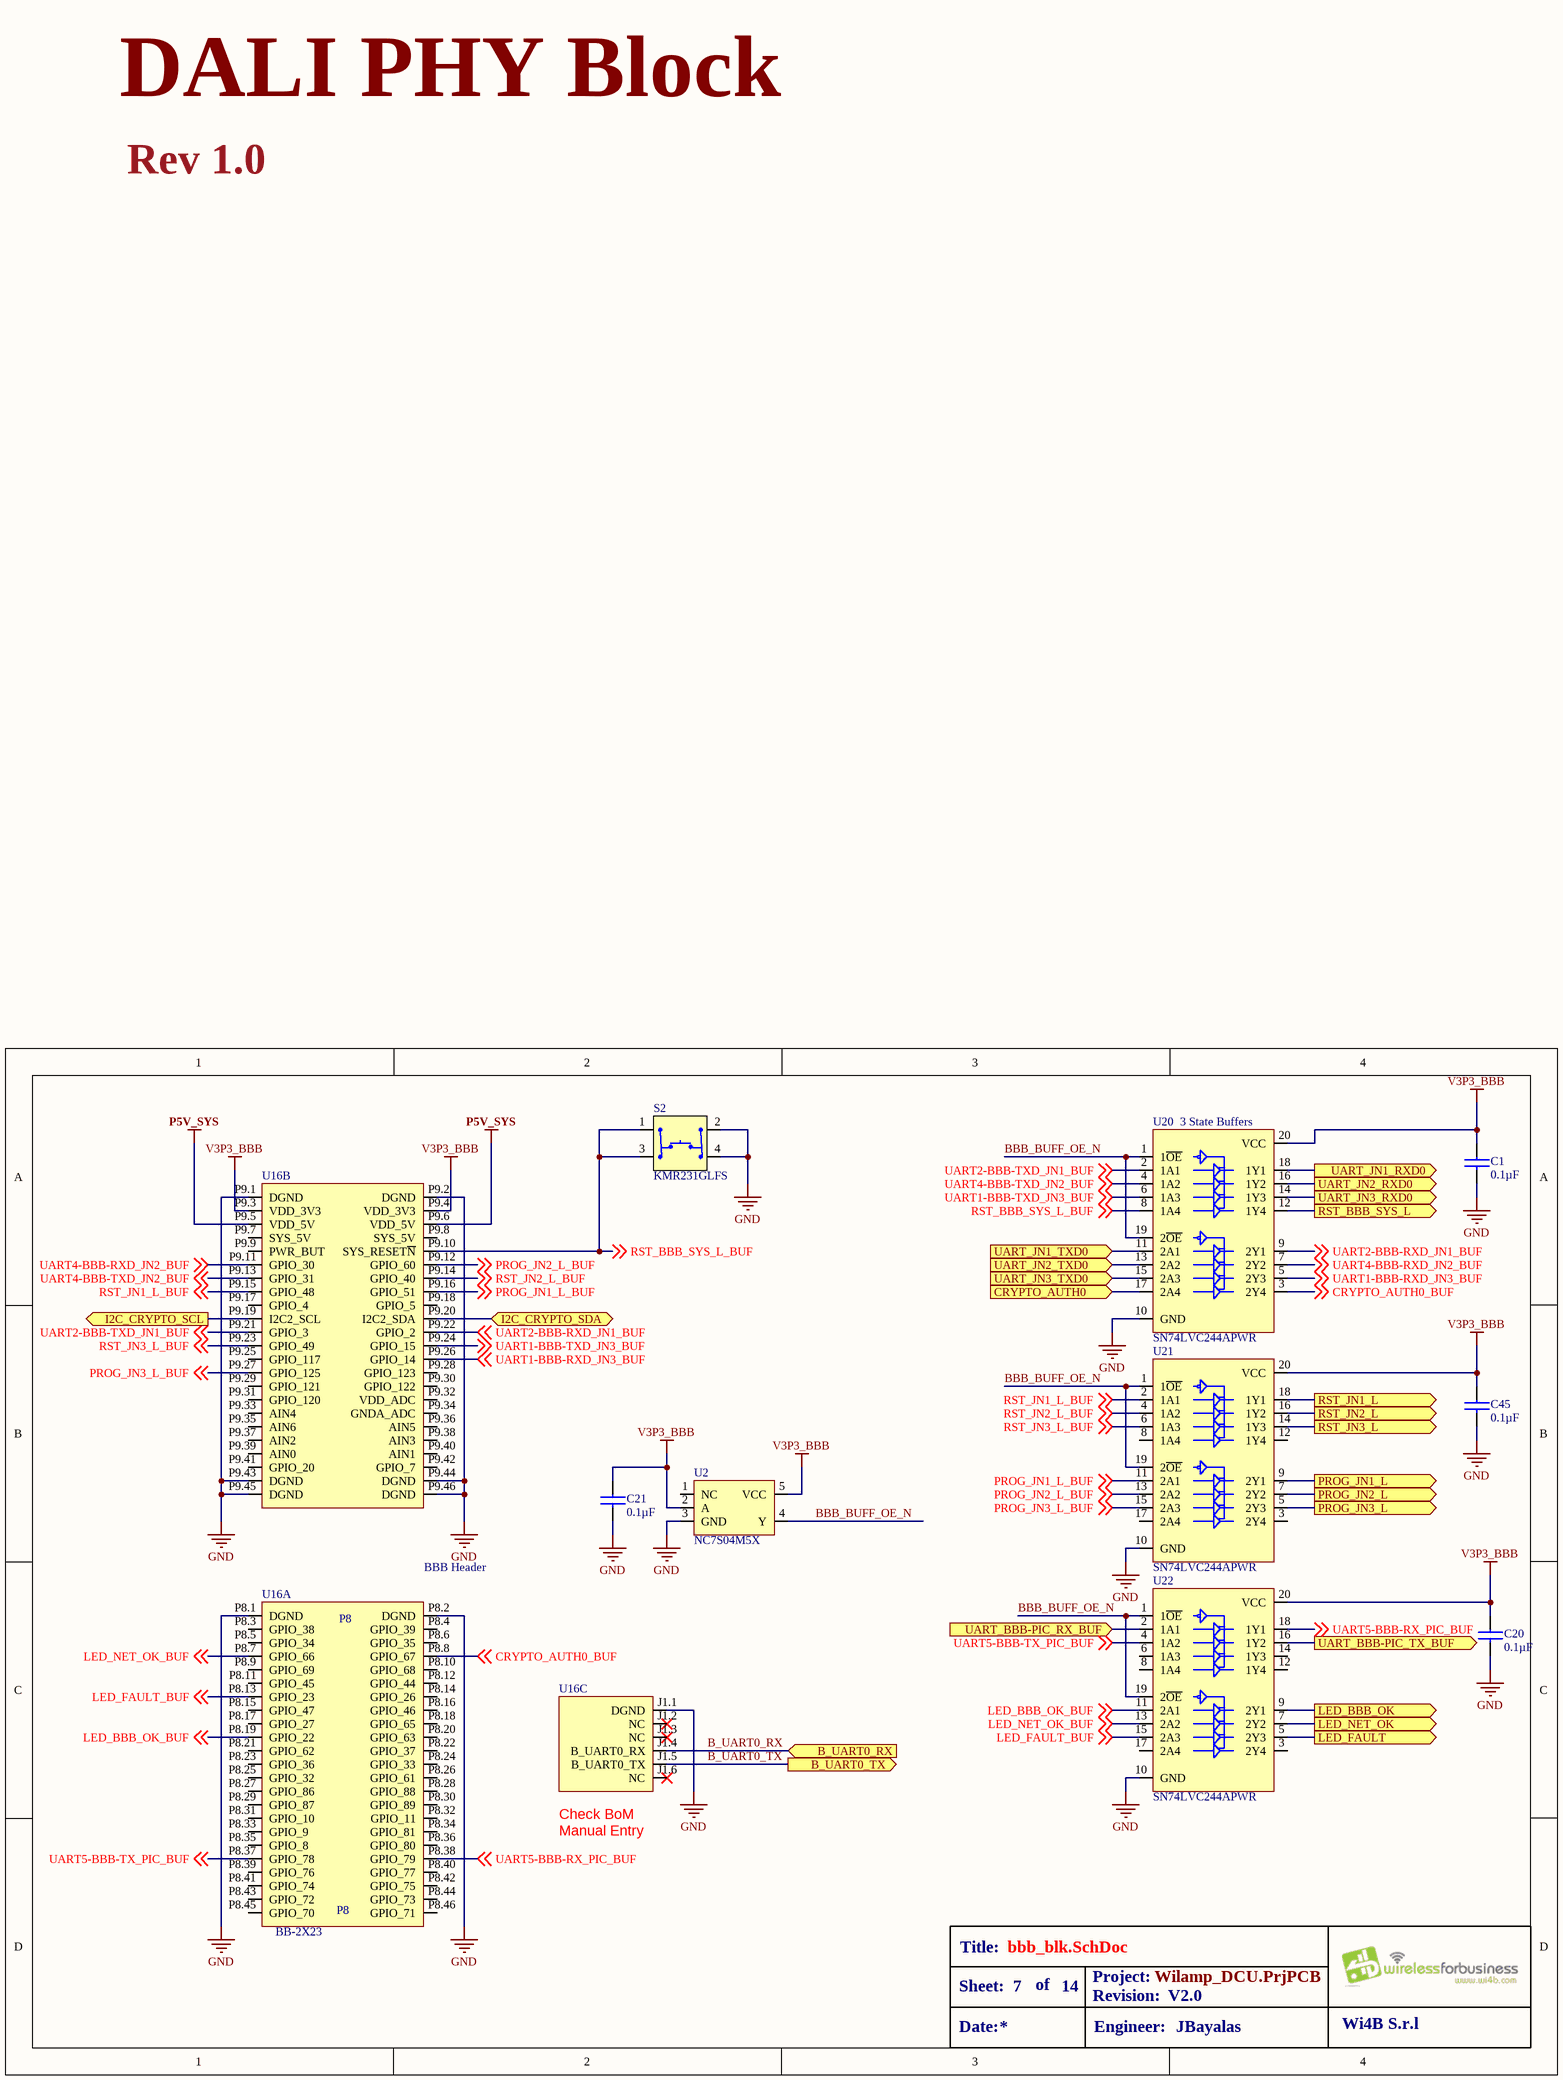
[diagram p4: bbb_blk.SchDoc]

### Parts
C1  value 0.1µF  [C0402]  (hidden comment: *)
C20  value 0.1µF  [C0402]  (hidden comment: *)
C21  value 0.1µF  [C0402]  (hidden comment: *)
C45  value 0.1µF  [C0402]  (hidden comment: *)
S2  *  [KMR231G ULC LFS]  (value not drawn)
U2  *  [SOT 23-5]  (value not drawn)
U16  MPN: BB-2X23  [BEAGLE_BONE_BLACK_CAPE]  (hidden comment: BEAGLE_BONE_BLACK_CAPE)  (parts A,B,C of 3)
U20  SN74LVC244APWR  [TSSOP-20 (SN74LVC)]
U21  SN74LVC244APWR  [TSSOP-20 (SN74LVC)]
U22  SN74LVC244APWR  [TSSOP-20 (SN74LVC)]

### Ports
B_UART0_RX (in), B_UART0_TX (out), CRYPTO_AUTH0 (in), I2C_CRYPTO_SCL (out), I2C_CRYPTO_SDA (bidir), LED_BBB_OK (out), LED_FAULT (out), LED_NET_OK (out), PROG_JN1_L (out), PROG_JN2_L (out), PROG_JN3_L (out), RST_BBB_SYS_L (out), RST_JN1_L (out), RST_JN2_L (out), RST_JN3_L (out), UART_BBB-PIC_RX_BUF (in), UART_BBB-PIC_TX_BUF (out), UART_JN1_RXD0 (out), UART_JN1_TXD0 (in), UART_JN2_RXD0 (out), UART_JN2_TXD0 (in), UART_JN3_RXD0 (out), UART_JN3_TXD0 (in)

### Nets
GND: C1.2 C20.2 C21.2 C45.2 S2.2 S2.4 U2.3(GND) U16.J1.1(DGND) U16.P8.1(DGND) U16.P8.2(DGND) U16.P9.1(DGND) U16.P9.2(DGND) U16.P9.43(DGND) U16.P9.44(DGND) U16.P9.45(DGND) U16.P9.46(DGND) U20.10(GND) U21.10(GND) U22.10(GND)
P5V_SYS: U16.P9.5(VDD_5V) U16.P9.6(VDD_5V)  [project net P5V0_SYS]
V3P3_BBB: C1.1 C20.1 C21.1 C45.1 U2.2(A) U2.5(VCC) U16.P9.3(VDD_3V3) U16.P9.4(VDD_3V3) U20.20(VCC) U21.20(VCC) U22.20(VCC)
B_UART0_RX: U16.J1.4(B_UART0_RX) ; port B_UART0_RX
B_UART0_TX: U16.J1.5(B_UART0_TX) ; port B_UART0_TX
BBB_BUFF_OE_N: U2.4(Y) U20.1(1~{OE}) U20.19(2~{OE}) U21.1(1~{OE}) U21.19(2~{OE}) U22.1(1~{OE}) U22.19(2~{OE})
BBB_UART5_RX_BUF: U22.2(1A1) ; port UART_BBB-PIC_RX_BUF
BBB_UART5_TX_BUF: U22.16(1Y2) ; port UART_BBB-PIC_TX_BUF
CRYPTO_AUTH0: U20.17(2A4) ; port CRYPTO_AUTH0
CRYPTO_AUTH0_BUF: U16.P8.8(GPIO_67) U20.3(2Y4) ; off-sheet CRYPTO_AUTH0_BUF
I2C_CRYPTO_SCL: U16.P9.19(I2C2_SCL) ; port I2C_CRYPTO_SCL
I2C_CRYPTO_SDA: U16.P9.20(I2C2_SDA) ; port I2C_CRYPTO_SDA
LED_BBB_OK: U22.9(2Y1) ; port LED_BBB_OK
LED_BBB_OK_BUF: U16.P8.19(GPIO_22) U22.11(2A1) ; off-sheet LED_BBB_OK_BUF
LED_FAULT: U22.5(2Y3) ; port LED_FAULT
LED_FAULT_BUF: U16.P8.13(GPIO_23) U22.15(2A3) ; off-sheet LED_FAULT_BUF
LED_NET_OK: U22.7(2Y2) ; port LED_NET_OK
LED_NET_OK_BUF: U16.P8.7(GPIO_66) U22.13(2A2) ; off-sheet LED_NET_OK_BUF
PROG_JN1_L: U21.9(2Y1) ; port PROG_JN1_L
PROG_JN1_L_BUF: U16.P9.16(GPIO_51) U21.11(2A1) ; off-sheet PROG_JN1_L_BUF
PROG_JN2_L: U21.7(2Y2) ; port PROG_JN2_L
PROG_JN2_L_BUF: U16.P9.12(GPIO_60) U21.13(2A2) ; off-sheet PROG_JN2_L_BUF
PROG_JN3_L: U21.5(2Y3) ; port PROG_JN3_L
PROG_JN3_L_BUF: U16.P9.27(GPIO_125) U21.15(2A3) ; off-sheet PROG_JN3_L_BUF
RST_BBB_SYS_L: U20.12(1Y4) ; port RST_BBB_SYS_L
RST_BBB_SYS_L_BUF: S2.1 S2.3 U16.P9.10(SYS_RESET~{N}) U20.8(1A4) ; off-sheet RST_BBB_SYS_L_BUF
RST_JN1_L: U21.18(1Y1) ; port RST_JN1_L
RST_JN1_L_BUF: U16.P9.15(GPIO_48) U21.2(1A1) ; off-sheet RST_JN1_L_BUF
RST_JN2_L: U21.16(1Y2) ; port RST_JN2_L
RST_JN2_L_BUF: U16.P9.14(GPIO_40) U21.4(1A2) ; off-sheet RST_JN2_L_BUF
RST_JN3_L: U21.14(1Y3) ; port RST_JN3_L
RST_JN3_L_BUF: U16.P9.23(GPIO_49) U21.6(1A3) ; off-sheet RST_JN3_L_BUF
UART1-BBB-RXD_JN3_BUF: U16.P9.26(GPIO_14) U20.5(2Y3) ; off-sheet UART1-BBB-RXD_JN3_BUF
UART1-BBB-TXD_JN3_BUF: U16.P9.24(GPIO_15) U20.6(1A3) ; off-sheet UART1-BBB-TXD_JN3_BUF
UART2-BBB-RXD_JN1_BUF: U16.P9.22(GPIO_2) U20.9(2Y1) ; off-sheet UART2-BBB-RXD_JN1_BUF
UART2-BBB-TXD_JN1_BUF: U16.P9.21(GPIO_3) U20.2(1A1) ; off-sheet UART2-BBB-TXD_JN1_BUF
UART4-BBB-RXD_JN2_BUF: U16.P9.11(GPIO_30) U20.7(2Y2) ; off-sheet UART4-BBB-RXD_JN2_BUF
UART4-BBB-TXD_JN2_BUF: U16.P9.13(GPIO_31) U20.4(1A2) ; off-sheet UART4-BBB-TXD_JN2_BUF
UART5-BBB-RX_PIC_BUF: U16.P8.38(GPIO_79) U22.18(1Y1) ; off-sheet UART5-BBB-RX_PIC_BUF
UART5-BBB-TX_PIC_BUF: U16.P8.37(GPIO_78) U22.4(1A2) ; off-sheet UART5-BBB-TX_PIC_BUF
UART_JN1_RXD0: U20.18(1Y1) ; port UART_JN1_RXD0
UART_JN1_TXD0: U20.11(2A1) ; port UART_JN1_TXD0
UART_JN2_RXD0: U20.16(1Y2) ; port UART_JN2_RXD0
UART_JN2_TXD0: U20.13(2A2) ; port UART_JN2_TXD0
UART_JN3_RXD0: U20.14(1Y3) ; port UART_JN3_RXD0
UART_JN3_TXD0: U20.15(2A3) ; port UART_JN3_TXD0

Not connected (* = marked no-connect by the designer): U2 1(NC); U16 J1.2(NC)* J1.3(NC)* J1.6(NC)* P8.3(GPIO_38) P8.4(GPIO_39) P8.5(GPIO_34) P8.6(GPIO_35) P8.9(GPIO_69) P8.10(GPIO_68) P8.11(GPIO_45) P8.12(GPIO_44) P8.14(GPIO_26) P8.15(GPIO_47) P8.16(GPIO_46) P8.17(GPIO_27) P8.18(GPIO_65) P8.20(GPIO_63) P8.21(GPIO_62) P8.22(GPIO_37) P8.23(GPIO_36) P8.24(GPIO_33) P8.25(GPIO_32) P8.26(GPIO_61) P8.27(GPIO_86) P8.28(GPIO_88) P8.29(GPIO_87) P8.30(GPIO_89) P8.31(GPIO_10) P8.32(GPIO_11) P8.33(GPIO_9) P8.34(GPIO_81) P8.35(GPIO_8) P8.36(GPIO_80) P8.39(GPIO_76) P8.40(GPIO_77) P8.41(GPIO_74) P8.42(GPIO_75) P8.43(GPIO_72) P8.44(GPIO_73) P8.45(GPIO_70) P8.46(GPIO_71) P9.7(SYS_5V) P9.8(SYS_5V) P9.9(PWR_BUT) P9.17(GPIO_4) P9.18(GPIO_5) P9.25(GPIO_117) P9.28(GPIO_123) P9.29(GPIO_121) P9.30(GPIO_122) P9.31(GPIO_120) P9.32(VDD_ADC) P9.33(AIN4) P9.34(GNDA_ADC) P9.35(AIN6) P9.36(AIN5) P9.37(AIN2) P9.38(AIN3) P9.39(AIN0) P9.40(AIN1) P9.41(GPIO_20) P9.42(GPIO_7); U21 3(2Y4) 8(1A4) 12(1Y4) 17(2A4); U22 3(2Y4) 6(1A3) 8(1A4) 12(1Y4) 14(1Y3) 17(2A4)

### Notes on the sheet
- DALI PHY Block
- Rev 1.0
- (near U20) 3 State Buffers
- (near U16) BBB Header
- (near U16) Check BoM Manual Entry
- Title:
- Sheet:
- Date:
- of
- Project:
- Revision:
- Engineer:
- Wi4B S.r.l
- (in symbol BEAGLE_BONE_BLACK_CAPE, part A) P8

### Library data of the parts
C1 C20 C21 C45 = CL05B104KO3LNNC: CAP CER 0.1UF 16V X7R 0402; MFT: Samsung Electro-Mechanics America, Inc.; RATING: ±10%, 16V; TYPE: Surface Mount, MLCC; FUNCTION: BBB; MPN: CL05B104KO3LNNC
S2 = KMR231GLFS: SWITCH TACTILE SPST-NO 0.05A 32V; MFT: C&K Components; FUNCTION: BBB; VALUE: KMR231GLFS; TYPE: SMD; MPN: KMR231GLFS
U2 = NC7S04M5X: IC INVERTER HS SINGLE SOT-23-5; MFT: ON Semiconductor; FUNCTION: BBB; LOAD: *; RATING: *; TYPE: SMD; VALUE: NC7S04M5X; MPN: NC7S04M5X
U16 = BEAGLE_BONE_BLACK_CAPE: Beaglebone 2x23 Pin stacking header(2 Pack ); MFT: Microrobotics; VALUE: BB-2X23; FUNCTION: BBB; TYPE: SMD; RATING: *; LOAD: *
U20-U22 = SN74LVC244APWR: IC BUFF/DVR TRI-ST DUAL 20TSSOP; MFT: Texas Instruments; FUNCTION: BBB; MPN: SN74LVC244APWR; TYPE: SMD; RATING: *; LOAD: *; VALUE: SN74LVC244APWR

## Sheet PowerInFilter.SchDoc
size A4; Engineer: JBayalas; DocumentNumber: 9; Revision: V1.1; SheetNumber: 9; SheetTotal: 13
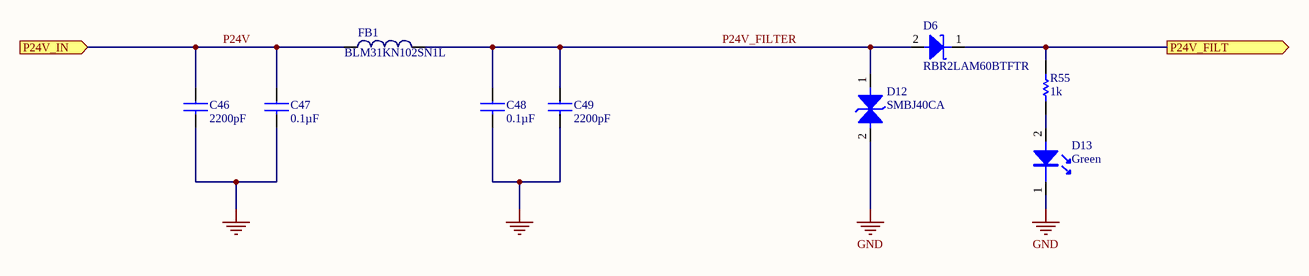
[diagram p5: PowerInFilter.SchDoc]

### Parts
C46  value 2200pF  [C0805]  (hidden comment: *)
C47  value 0.1µF  [C0805]  (hidden comment: *)
C48  value 0.1µF  [C0805]  (hidden comment: *)
C49  value 2200pF  [C0805]  (hidden comment: *)
D6  value RBR2LAM60BTFTR  [SOD128]  (hidden comment: *)
D12  value SMBJ40CA  [DO-214AA (SMBJ40CA)]  (hidden comment: *)
D13  value Green  [LED0402(GREEN)]  (hidden comment: *)
FB1  value BLM31KN102SN1L  [1206 INDUCTOR]  (hidden comment: *)
R55  value 1k  [R0603]  (hidden comment: *)

### Ports
P24V_FILT (out), P24V_IN (in)

### Nets
GND: C46.2 C47.2 C48.2 C49.2 D12.2(anode) D13.1
P24V_FILT: D6.1(cathode) R55.2 ; port P24V_FILT
P24V: C46.1 C47.1 FB1.2 ; port P24V_IN
P24V_FILTER: C48.1 C49.1 D6.2(anode) D12.1(cathode) FB1.1
NetD13_2: D13.2 R55.1

### Notes on the sheet
- Title:
- Sheet:
- Date:
- of
- Project:
- Revision:
- Engineer:
- Wi4B S.r.l

### Library data of the parts
C46 C49 = 08055C222KAT2A: CAP CER 2200PF 50V 10% X7R 0805; MFT: AVX Corporation; TYPE: Surface Mount, MLCC; FUNCTION: PwrInFilter; MPN: 08055C222KAT2A; RATING: 50V 10% X7R
C47 C48 = GCM21BR72A104KA37L: CAP CER 0.1UF 100V X7R 0805; MFT: Murata Electronics North America; TYPE: Surface Mount, MLCC; FUNCTION: PwrInFilter; MPN: GCM21BR72A104KA37L; RATING: 100V
D6 = RBR2LAM60BTFTR: AUTOMOTIVE SCHOTTKY BARRIER DIOD; MFT: Rohm; RATING: 60V 2A; TYPE: SMD; FUNCTION: PwrInFilter; MPN: RBR2LAM60BTFTR; LOAD: *
D12 = SMBJ40CA: TVS DIODE 40VWM 64.5VC DO214AA; MFT: Bourns; TYPE: SMD; FUNCTION: PwrInFilter; MPN: SMBJ40CA; RATING: *; LOAD: *
D13 = LNJ347W83RA: LED GREEN 0402 SMD; MFT: Panasonic Electronic Components; TYPE: Surface Mount; FUNCTION: PwrInFilter; MPN: LNJ347W83RA
FB1 = BLM31KN102SN1L: FERRITE BEAD 1 KOHM 1206 1LN; MFT: Murata; TYPE: SMD; RATING: 1 KOHM; FUNCTION: PwrInFilter; MPN: BLM31KN102SN1L; LOAD: *
R55 = ERJ-3EKF1001V: RES SMD 1K OHM 1% 1/10W 0603; MFT: Panasonic Electronic Components; RATING: 0.1W; FUNCTION: PwrInFilter; MPN: ERJ-3EKF1001V; TYPE: Surface Mount

## Sheet LED.SchDoc
size A4; Engineer: JBayalas; DocumentNumber: 10; Revision: V1.1; SheetNumber: 10; SheetTotal: 13
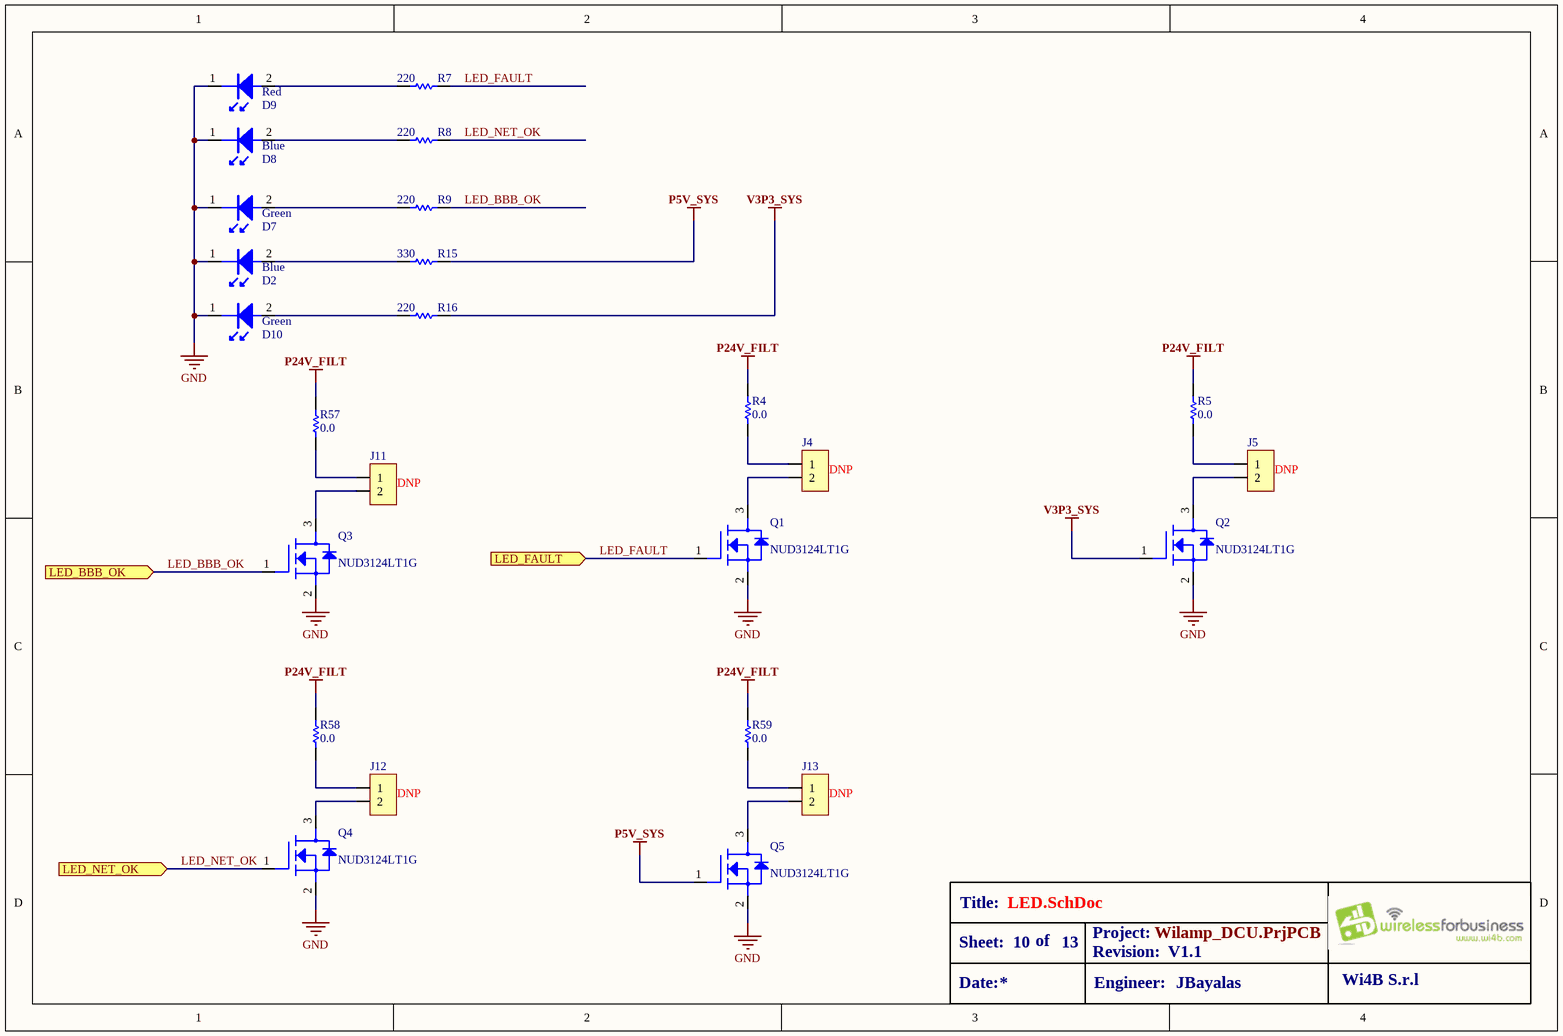
[diagram p6: LED.SchDoc]

### Parts
D2  value Blue  [LED0402(BLUE)]  (hidden comment: *)
D7  value Green  [LED0402(GREEN)]  (hidden comment: *)
D8  value Blue  [LED0402(BLUE)]  (hidden comment: *)
D9  value Red  [LED0402(RED)]  (hidden comment: *)
D10  value Green  [LED0402(GREEN)]  (hidden comment: *)
J4  LOAD: DNP  [2pin 5mm Pitch]  (hidden comment: *)
J5  LOAD: DNP  [2pin 5mm Pitch]  (hidden comment: *)
J11  LOAD: DNP  [2pin 5mm Pitch]  (hidden comment: *)
J12  LOAD: DNP  [2pin 5mm Pitch]  (hidden comment: *)
J13  LOAD: DNP  [2pin 5mm Pitch]  (hidden comment: *)
Q1  *  [SOT-23-3]  (value not drawn)
Q2  *  [SOT-23-3]  (value not drawn)
Q3  *  [SOT-23-3]  (value not drawn)
Q4  *  [SOT-23-3]  (value not drawn)
Q5  *  [SOT-23-3]  (value not drawn)
R4  value 0.0  [R1206]  (hidden comment: *)
R5  value 0.0  [R1206]  (hidden comment: *)
R7  value 220  [R0402]  (hidden comment: *)
R8  value 220  [R0402]  (hidden comment: *)
R9  value 220  [R0402]  (hidden comment: *)
R15  value 330  [R0402]  (hidden comment: *)
R16  value 220  [R0402]  (hidden comment: *)
R57  value 0.0  [R1206]  (hidden comment: *)
R58  value 0.0  [R1206]  (hidden comment: *)
R59  value 0.0  [R1206]  (hidden comment: *)

### Ports
LED_BBB_OK (in), LED_FAULT (in), LED_NET_OK (in)

### Nets
GND: D2.1 D7.1 D8.1 D9.1 D10.1 Q1.2(source) Q2.2(source) Q3.2(source) Q4.2(source) Q5.2(source)
P5V_SYS: Q5.1(gate) R15.2  [project net P5V0_SYS]
P24V_FILT: R4.2 R5.2 R57.2 R58.2 R59.2
V3P3_SYS: Q2.1(gate) R16.2
LED_BBB_OK: Q3.1(gate) R9.2 ; port LED_BBB_OK
LED_FAULT: Q1.1(gate) R7.2 ; port LED_FAULT
LED_NET_OK: Q4.1(gate) R8.2 ; port LED_NET_OK
NetD2_2: D2.2 R15.1
NetD7_2: D7.2 R9.1
NetD8_2: D8.2 R8.1
NetD9_2: D9.2 R7.1
NetD10_2: D10.2 R16.1
NetJ4_1: J4.1 R4.1
NetJ4_2: J4.2 Q1.3(drain)
NetJ5_1: J5.1 R5.1
NetJ5_2: J5.2 Q2.3(drain)
NetJ11_1: J11.1 R57.1
NetJ11_2: J11.2 Q3.3(drain)
NetJ12_1: J12.1 R58.1
NetJ12_2: J12.2 Q4.3(drain)
NetJ13_1: J13.1 R59.1
NetJ13_2: J13.2 Q5.3(drain)

### Notes on the sheet
- Title:
- Sheet:
- Date:
- of
- Project:
- Revision:
- Engineer:
- Wi4B S.r.l

### Library data of the parts
D2 D8 = VLMB1500-GS08: LED BLUE 0402 SMD; MFT: Vishay Semiconductor Opto Division; MPN: VLMB1500-GS08; TYPE: SMD; RATING: *; LOAD: *; FUNCTION: LED
D7 D10 = LNJ347W83RA: LED GREEN 0402 SMD; MFT: Panasonic Electronic Components; TYPE: Surface Mount; MPN: LNJ347W83RA; FUNCTION: LED
D9 = LNJ247W82RA: LED RED 0402 SMD; MFT: Panasonic Electronic Components; TYPE: Surface Mount; MPN: LNJ247W82RA; FUNCTION: LED
J4 J5 J11-J13 = 2PIN Signal 5mm Pitch: FUNCTION: LED
Q1-Q5 = NUD3124LT1G: IC INDCT LOAD DRVR AUTO SOT23; MFT: ON Semiconductor; TYPE: Surface Mount; FUNCTION: LED; VALUE: NUD3124LT1G; MPN: NUD3124LT1G
R4 R5 R57-R59 = RC1206JR-070RL: RES SMD 0.0 OHM JUMPER 1/4W 1206; MFT: Yageo; FUNCTION: LED; MPN: RC1206JR-070RL; TYPE: Surface Mount
R7-R9 R16 = RC0402JR-07220RL: RES SMD 220 OHM 5% 1/16W 0402; MFT: Yageo; FUNCTION: LED; MPN: RC0402JR-07220RL; RATING: *; TYPE: SMD; LOAD: *
R15 = CRCW0402330RFKED: RES SMD 330 OHM 1% 1/16W 0402; MFT: Vishay Dale; FUNCTION: LED; MPN: CRCW0402330RFKED; TYPE: SMD; RATING: 1/16W; LOAD: *

## Sheet USB_Mini.SchDoc
size A4; Engineer: JBayalas; DocumentNumber: 9; Revision: V2.0; SheetNumber: 9; SheetTotal: 14
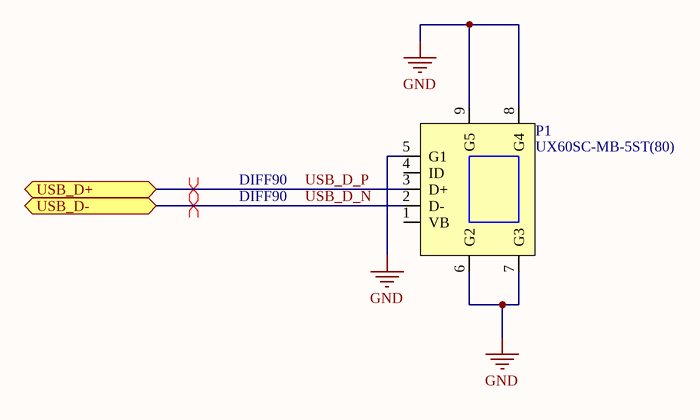
[diagram p7: USB_Mini.SchDoc]

### Parts
P1  *  [UX60SC-MB-5ST(80)]  (value not drawn)

### Ports
USB_D+ (bidir), USB_D- (bidir)

### Nets
GND: P1.5(G1) P1.6(G2) P1.7(G3) P1.8(G4) P1.9(G5)
USB_D_N: P1.2(D-) ; port USB_D-
USB_D_P: P1.3(D+) ; port USB_D+

Not connected (* = marked no-connect by the designer): P1 1(VB) 4(ID)

### Layout directives
differential pair; net class DIFF90: USB_D_N, USB_D_P

### Notes on the sheet
- Title:
- Sheet:
- Date:
- of
- Project:
- Revision:
- Engineer:
- Wi4B S.r.l

### Library data of the parts
P1 = UX60SC-MB-5ST(80): CONN RCPT USB MINI B R/A SMD; MFT: Hirose Electric Co Ltd; VALUE: UX60SC-MB-5ST(80); TYPE: SMD; RATING: *; LOAD: *; MPN: UX60SC-MB-5ST(80); FUNCTION: USB

## Sheet 5v_dcdc_blk.SchDoc
size A4; Engineer: JBayalas; DocumentNumber: 13; Revision: V1.1; SheetNumber: 13; SheetTotal: 13
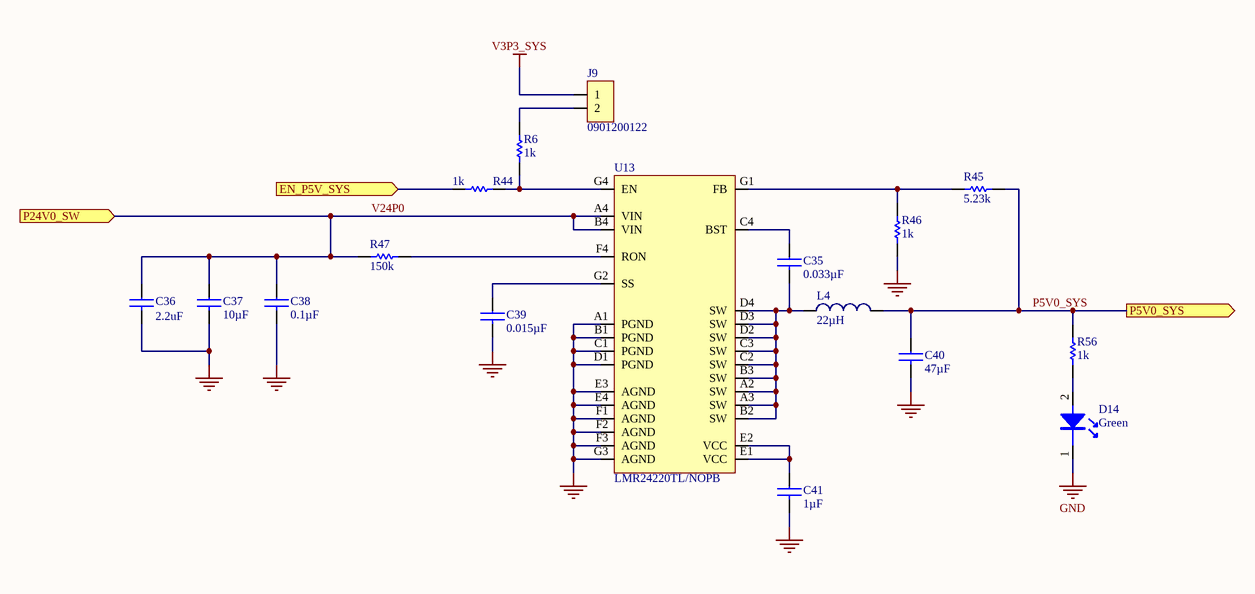
[diagram p8: 5v_dcdc_blk.SchDoc]

### Parts
C35  value 0.033µF  [C0402]  (hidden comment: *)
C36  value 2.2uF  [C0603]  (hidden comment: *)
C37  value 10µF  [C1210]  (hidden comment: *)
C38  value 0.1µF  [C0805]  (hidden comment: *)
C39  value 0.015µF  [C0402]  (hidden comment: *)
C40  value 47µF  [C1206]  (hidden comment: *)
C41  value 1µF  [C0603]  (hidden comment: *)
D14  value Green  [LED0402(GREEN)]  (hidden comment: *)
J9  *  [0901200122]  (value not drawn)
L4  value 22µH  [MPI4040R3-220-R]  (hidden comment: MPI4040R3-220-R)
R6  value 1k  [R0603]  (hidden comment: *)
R44  value 1k  [R0402]  (hidden comment: *)
R45  value 5.23k  [R0402]  (hidden comment: *)
R46  value 1k  [R0402]  (hidden comment: *)
R47  value 150k  [R0402]  (hidden comment: *)
R56  value 1k  [R0603]  (hidden comment: *)
U13  *  [DSBGA-28]  (value not drawn)

### Ports
EN_P5V_SYS (in), P5V0_SYS (out), P24V0_SW (in)

### Nets
GND: C36.2 C37.2 C38.2 C39.2 C40.2 C41.2 D14.1 R46.2 U13.A1(PGND) U13.B1(PGND) U13.C1(PGND) U13.D1(PGND) U13.E3(AGND) U13.E4(AGND) U13.F1(AGND) U13.F2(AGND) U13.F3(AGND) U13.G3(AGND)
P5V0_SYS: C40.1 L4.1 R45.1 R56.2 ; port P5V0_SYS
V3P3_SYS: J9.1
EN_P5V_SYS: R44.2 ; port EN_P5V_SYS
V24P0: C36.1 C37.1 C38.1 R47.2 U13.A4(VIN) U13.B4(VIN) ; port P24V0_SW
NetC35_1: C35.1 U13.C4(BST)
NetC35_2: C35.2 L4.2 U13.A2(SW) U13.A3(SW) U13.B2(SW) U13.B3(SW) U13.C2(SW) U13.C3(SW) U13.D2(SW) U13.D3(SW) U13.D4(SW)
NetC39_1: C39.1 U13.G2(SS)
NetC41_1: C41.1 U13.E1(VCC) U13.E2(VCC)
NetD14_2: D14.2 R56.1
NetJ9_2: J9.2 R6.2
NetR6_1: R6.1 R44.1 U13.G4(EN)
NetR45_2: R45.2 R46.1 U13.G1(FB)
NetR47_1: R47.1 U13.F4(RON)

### Notes on the sheet
- Title:
- Sheet:
- Date:
- of
- Project:
- Revision:
- Engineer:
- Wi4B S.r.l

### Library data of the parts
C35 = GRM155R71E333KA88D: CAP CER 0.033UF 25V X7R 0402; MFT: Murata; TYPE: Surface Mount; FUNCTION: 5v_dcdc; MPN: GRM155R71E333KA88D; RATING: 25V
C36 = C1608X5R1V225K080AC: CAP CER 2.2UF 35V X5R 0603; MFT: TDK Corporation; TYPE: SMD; FUNCTION: 5v_dcdc; MPN: C1608X5R1V225K080AC; RATING: 35V; LOAD: *
C37 = GRM32ER7YA106KA12L: CAP CER 10UF 35V X7R 1210; MFT: Murata Electronics North America; TYPE: Surface Mount, MLCC; FUNCTION: 5v_dcdc; MPN: GRM32ER7YA106KA12L; RATING: 35V
C38 = C0805C104K5RACTU: CAP CER 0.1UF 50V X7R 0805; MFT: Kemet; TYPE: Surface Mount, MLCC; FUNCTION: 5v_dcdc; MPN: C0805C104K5RACTU; RATING: 50V
C39 = GRM155R71E153KA61D: CAP CER 0.015UF 25V X7R 0402; TYPE: Surface Mount, MLCC; MFT: Murata Electronics North America; FUNCTION: 5v_dcdc; RATING: 25V; MPN: GRM155R71E153KA61D
C40 = GRM31CR61A476KE15L: CAP CER 47UF 10V X5R 1206; MFT: Murata Electronics North America; TYPE: Surface Mount, MLCC; FUNCTION: 5v_dcdc; MPN: GRM31CR61A476KE15L; RATING: 10V
C41 = GRM188R61E105KA12D: CAP CER 1UF 25V X5R 0603; MFT: Murata Electronics North America; TYPE: Surface Mount; FUNCTION: 5v_dcdc; MPN: GRM188R61E105KA12D; RATING: 25V
D14 = LNJ347W83RA: LED GREEN 0402 SMD; MFT: Panasonic Electronic Components; TYPE: Surface Mount; FUNCTION: 5v_dcdc; MPN: LNJ347W83RA
J9 = 0901200122: CONN HEADER 2POS .100" STR TIN; MFT: Molex, LLC; FUNCTION: 5v_dcdc; TYPE: Through Hole; VALUE: 0901200122; MPN: 0901200122
L4 = MPI4040R3-220-R: FIXED IND 22UH 1.1A 408 MOHM SMD; MFT: Eaton Bussmann; FUNCTION: 5v_dcdc; MPN: MPI4040R3-220-R; TYPE: SMD; RATING: 1.1A 408 MOHM; DNP: *
R6 = 6-1879336-2: RES SMD 1K OHM 1% 1/16W 0603; MFT: TE Connectivity AMP Connectors; RATING: 0.063W; FUNCTION: 5v_dcdc; MPN: 6-1879336-2; TYPE: SMD; LOAD: *
R44 R46 = CRCW04021K00FKED: RES SMD 1K OHM 1% 1/16W 0402; RATING: 0.063W; MFT: Vishay Dale; FUNCTION: 5v_dcdc; MPN: CRCW04021K00FKED; TYPE: Surface Mount
R45 = CRCW04025K23FKED: RES SMD 5.23K OHM 1% 1/16W 0402; RATING: 0.063W; MFT: Vishay Dale; FUNCTION: 5v_dcdc; TYPE: Surface Mount; MPN: CRCW04025K23FKED
R47 = CRCW0402150KFKED: RES SMD 150K OHM 1% 1/16W 0402; MFT: Vishay Dale; RATING: 63mW; FUNCTION: 5v_dcdc; MPN: CRCW0402150KFKED; TYPE: Surface Mount
R56 = ERJ-3EKF1001V: RES SMD 1K OHM 1% 1/10W 0603; MFT: Panasonic Electronic Components; RATING: 0.1W; FUNCTION: 5v_dcdc; MPN: ERJ-3EKF1001V; TYPE: Surface Mount
U13 = LMR24220TL/NOPB: Voltage Regulators - Switching Regulators 42VIN,2A SIMPLE SW NANO STEP-DOWN REG; MFT: Texas Instruments; FUNCTION: 5v_dcdc; TYPE: Surface Mount; VALUE: LMR24220TL/NOPB; MPN: LMR24220TL/NOPB

## Sheet 3v3_dcdc_blk.SchDoc
size A4; Engineer: JBayalas; DocumentNumber: 12; Revision: V1.1; SheetNumber: 12; SheetTotal: 13
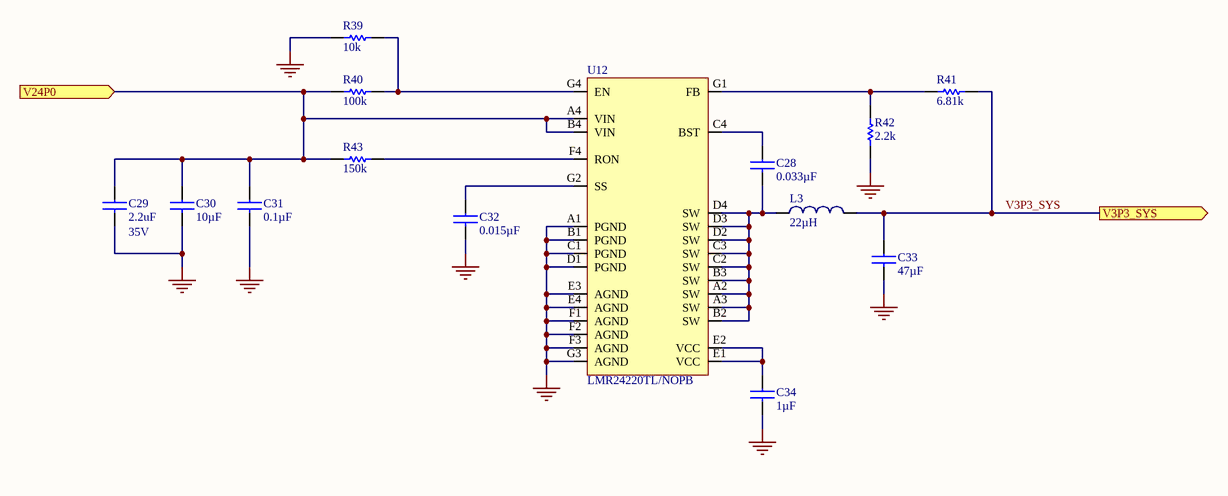
[diagram p9: 3v3_dcdc_blk.SchDoc]

### Parts
C28  value 0.033µF  [C0402]  (hidden comment: *)
C29  value 2.2uF  RATING: 35V  [C0603]  (hidden comment: *)
C30  value 10µF  [C1210]  (hidden comment: *)
C31  value 0.1µF  [C0805]  (hidden comment: *)
C32  value 0.015µF  [C0402]  (hidden comment: *)
C33  value 47µF  [C1206]  (hidden comment: *)
C34  value 1µF  [C0603]  (hidden comment: *)
L3  value 22µH  [MPI4040R3-220-R]  (hidden comment: MPI4040R3-220-R)
R39  value 10k  [R0402]  (hidden comment: *)
R40  value 100k  [R0402]  (hidden comment: *)
R41  value 6.81k  [R0402]  (hidden comment: *)
R42  value 2.2k  [R0402]  (hidden comment: *)
R43  value 150k  [R0402]  (hidden comment: *)
U12  *  [DSBGA-28]  (value not drawn)

### Ports
V3P3_SYS (out), V24P0 (in)

### Nets
GND: C29.2 C30.2 C31.2 C32.2 C33.2 C34.2 R39.1 R42.1 U12.A1(PGND) U12.B1(PGND) U12.C1(PGND) U12.D1(PGND) U12.E3(AGND) U12.E4(AGND) U12.F1(AGND) U12.F2(AGND) U12.F3(AGND) U12.G3(AGND)
V3P3_SYS: C33.1 L3.1 R41.2 ; port V3P3_SYS
V24P0: C29.1 C30.1 C31.1 R40.2 R43.2 U12.A4(VIN) U12.B4(VIN) ; port V24P0
NetC28_1: C28.1 U12.C4(BST)
NetC28_2: C28.2 L3.2 U12.A2(SW) U12.A3(SW) U12.B2(SW) U12.B3(SW) U12.C2(SW) U12.C3(SW) U12.D2(SW) U12.D3(SW) U12.D4(SW)
NetC32_1: C32.1 U12.G2(SS)
NetC34_1: C34.1 U12.E1(VCC) U12.E2(VCC)
NetR39_2: R39.2 R40.1 U12.G4(EN)
NetR41_1: R41.1 R42.2 U12.G1(FB)
NetR43_1: R43.1 U12.F4(RON)

### Notes on the sheet
- Title:
- Sheet:
- Date:
- of
- Project:
- Revision:
- Engineer:
- Wi4B S.r.l

### Library data of the parts
C28 = GRM155R71E333KA88D: CAP CER 0.033UF 25V X7R 0402; MFT: Murata; TYPE: Surface Mount; FUNCTION: 3v3_dcdc; MPN: GRM155R71E333KA88D; RATING: 25V
C29 = C1608X5R1V225K080AC: CAP CER 2.2UF 35V X5R 0603; MFT: TDK Corporation; TYPE: SMD; FUNCTION: 3v3_dcdc; MPN: C1608X5R1V225K080AC; LOAD: *
C30 = GRM32ER7YA106KA12L: CAP CER 10UF 35V X7R 1210; MFT: Murata Electronics North America; TYPE: Surface Mount, MLCC; FUNCTION: 3v3_dcdc; MPN: GRM32ER7YA106KA12L; RATING: 35V
C31 = C0805C104K5RACTU: CAP CER 0.1UF 50V X7R 0805; MFT: Kemet; TYPE: Surface Mount, MLCC; FUNCTION: 3v3_dcdc; MPN: C0805C104K5RACTU; RATING: 50V
C32 = GRM155R71E153KA61D: CAP CER 0.015UF 25V X7R 0402; TYPE: Surface Mount, MLCC; MFT: Murata Electronics North America; FUNCTION: 3v3_dcdc; RATING: 25V; MPN: GRM155R71E153KA61D
C33 = GRM31CR61A476KE15L: CAP CER 47UF 10V X5R 1206; MFT: Murata Electronics North America; TYPE: Surface Mount, MLCC; FUNCTION: 3v3_dcdc; MPN: GRM31CR61A476KE15L; RATING: 10V
C34 = GRM188R61E105KA12D: CAP CER 1UF 25V X5R 0603; MFT: Murata Electronics North America; TYPE: Surface Mount; FUNCTION: 3v3_dcdc; MPN: GRM188R61E105KA12D; RATING: 25V
L3 = MPI4040R3-220-R: FIXED IND 22UH 1.1A 408 MOHM SMD; MFT: Eaton Bussmann; FUNCTION: 3v3_dcdc; MPN: MPI4040R3-220-R; TYPE: SMD; RATING: 1.1A 408 MOHM; DNP: *
R39 = CRCW040210K0JNED: RES SMD 10K OHM 5% 1/16W 0402; MFT: Vishay Dale; RATING: 0.063W, 1/16W; FUNCTION: 3v3_dcdc; MPN: CRCW040210K0JNED; TYPE: Surface Mount
R40 = CRCW0402100KFKED: RES SMD 100K OHM 1% 1/16W 0402; RATING: 0.063W; MFT: Vishay Dale; FUNCTION: 3v3_dcdc; TYPE: Surface Mount; MPN: CRCW0402100KFKED
R41 = RT0402BRD076K81L: RES SMD 6.81KOHM 0.1% 1/16W 0402; MFT: Yageo; FUNCTION: 3v3_dcdc; MPN: RT0402BRD076K81L; RATING: 1/16W; LOAD: *; TYPE: SMD
R42 = ERJ-2RKF2201X: RES SMD 2.2K OHM 1% 1/10W 0402; MFT: Panasonic Electronic Components; RATING: 0.1W, 1/10W; FUNCTION: 3v3_dcdc; MPN: ERJ-2RKF2201X; TYPE: Surface Mount
R43 = CRCW0402150KFKED: RES SMD 150K OHM 1% 1/16W 0402; MFT: Vishay Dale; RATING: 63mW; FUNCTION: 3v3_dcdc; MPN: CRCW0402150KFKED; TYPE: Surface Mount
U12 = LMR24220TL/NOPB: Voltage Regulators - Switching Regulators 42VIN,2A SIMPLE SW NANO STEP-DOWN REG; MFT: Texas Instruments; FUNCTION: 3v3_dcdc; TYPE: Surface Mount; VALUE: LMR24220TL/NOPB; MPN: LMR24220TL/NOPB

## Sheet headerP3_blk.SchDoc
size A4; Engineer: JBayalas; DocumentNumber: 7; Revision: V1.1; SheetNumber: 7; SheetTotal: 13
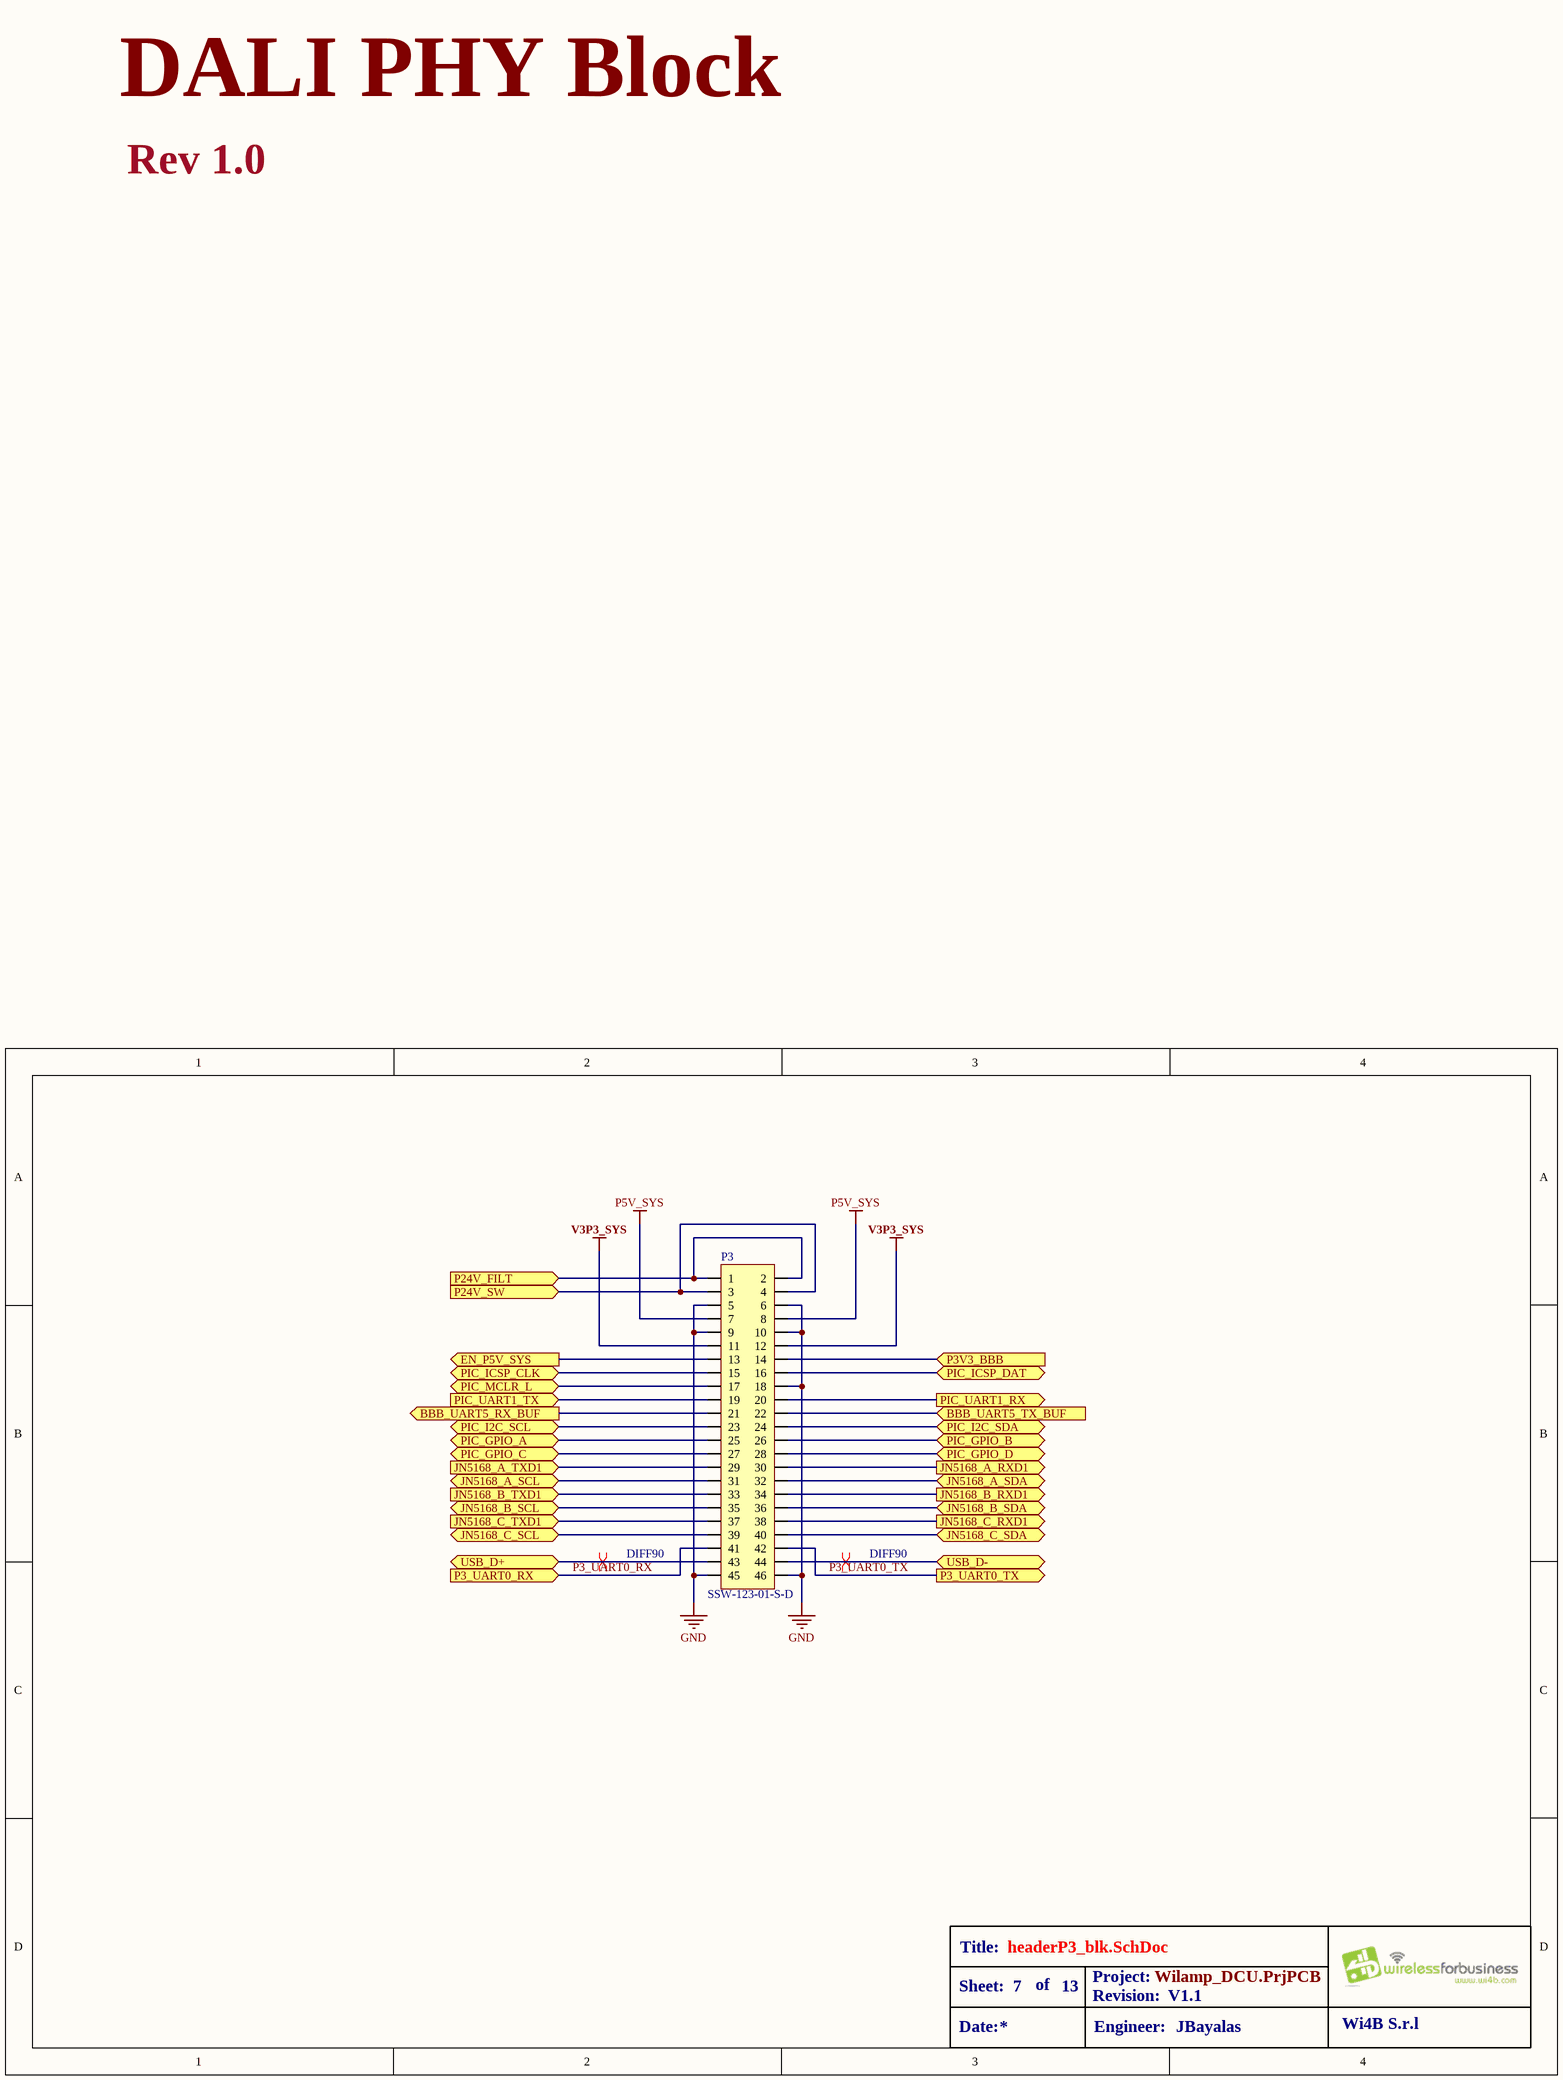
[diagram p10: headerP3_blk.SchDoc]

### Parts
P3  value SSW-123-01-S-D  [2x23 Header Female]  (hidden comment: *)

### Ports
BBB_UART5_RX_BUF (out), BBB_UART5_TX_BUF (in), EN_P5V_SYS (out), JN5168_A_RXD1 (out), JN5168_A_SCL, JN5168_A_SDA, JN5168_A_TXD1 (in), JN5168_B_RXD1 (out), JN5168_B_SCL, JN5168_B_SDA, JN5168_B_TXD1 (in), JN5168_C_RXD1 (out), JN5168_C_SCL, JN5168_C_SDA, JN5168_C_TXD1 (in), P3_UART0_RX (in), P3_UART0_TX (out), P3V3_BBB (in), P24V_FILT (in), P24V_SW (in), PIC_GPIO_A, PIC_GPIO_B, PIC_GPIO_C, PIC_GPIO_D, PIC_I2C_SCL, PIC_I2C_SDA, PIC_ICSP_CLK, PIC_ICSP_DAT, PIC_MCLR_L, PIC_UART1_RX (out), PIC_UART1_TX (in), USB_D+, USB_D-

### Nets
GND: P3.5 P3.6 P3.9 P3.10 P3.18 P3.45 P3.46
P5V_SYS: P3.7 P3.8  [project net P5V0_SYS]
P24_SW: P3.3 P3.4 ; port P24V_SW
P24V_FILT: P3.1 P3.2 ; port P24V_FILT
V3P3_BBB: P3.14 ; port P3V3_BBB
V3P3_SYS: P3.11 P3.12
BBB_UART5_RX_BUF: P3.21 ; port BBB_UART5_RX_BUF
BBB_UART5_TX_BUF: P3.22 ; port BBB_UART5_TX_BUF
EN_P5V_SYS: P3.13 ; port EN_P5V_SYS
I2C_JN_SCL: P3.31 ; port JN5168_A_SCL
I2C_JN_SCL: P3.35 ; port JN5168_B_SCL  [a separate net that carries the same name]
I2C_JN_SCL: P3.39 ; port JN5168_C_SCL  [a separate net that carries the same name]
I2C_JN_SDA: P3.32 ; port JN5168_A_SDA
I2C_JN_SDA: P3.36 ; port JN5168_B_SDA  [a separate net that carries the same name]
I2C_JN_SDA: P3.40 ; port JN5168_C_SDA  [a separate net that carries the same name]
P3_UART0_RX: P3.41 ; port P3_UART0_RX  [project net B_UART0_TX]
P3_UART0_TX: P3.42 ; port P3_UART0_TX  [project net B_UART0_RX]
PIC_GPIO_A: P3.25 ; port PIC_GPIO_A
PIC_GPIO_B: P3.26 ; port PIC_GPIO_B
PIC_GPIO_C: P3.27 ; port PIC_GPIO_C
PIC_GPIO_D: P3.28 ; port PIC_GPIO_D
PIC_I2C_SCL: P3.23 ; port PIC_I2C_SCL
PIC_I2C_SDA: P3.24 ; port PIC_I2C_SDA
PIC_ICSP_CLK: P3.15 ; port PIC_ICSP_CLK
PIC_ICSP_DAT: P3.16 ; port PIC_ICSP_DAT
PIC_MCLR: P3.17 ; port PIC_MCLR_L
PIC_UART1_RX: P3.20 ; port PIC_UART1_RX
PIC_UART1_TX: P3.19 ; port PIC_UART1_TX
USB_D_N: P3.44 ; port USB_D-
USB_D_P: P3.43 ; port USB_D+
NetP3_29: P3.29 ; port JN5168_A_TXD1
NetP3_30: P3.30 ; port JN5168_A_RXD1
NetP3_33: P3.33 ; port JN5168_B_TXD1
NetP3_34: P3.34 ; port JN5168_B_RXD1
NetP3_37: P3.37 ; port JN5168_C_TXD1
NetP3_38: P3.38 ; port JN5168_C_RXD1

### Layout directives
differential pair; net class DIFF90: USB_D_N, USB_D_P

### Notes on the sheet
- DALI PHY Block
- Rev 1.0
- Title:
- Sheet:
- Date:
- of
- Project:
- Revision:
- Engineer:
- Wi4B S.r.l

### Library data of the parts
P3 = SSW-123-01-S-D: CONN RCPT .100" 46POS DUAL GOLD; MFT: Samtec; FUNCTION: P3; MPN: SSW-123-01-S-D; RATING: *; TYPE: TH; LOAD: *